# Altium project Backplane.PrjPcb
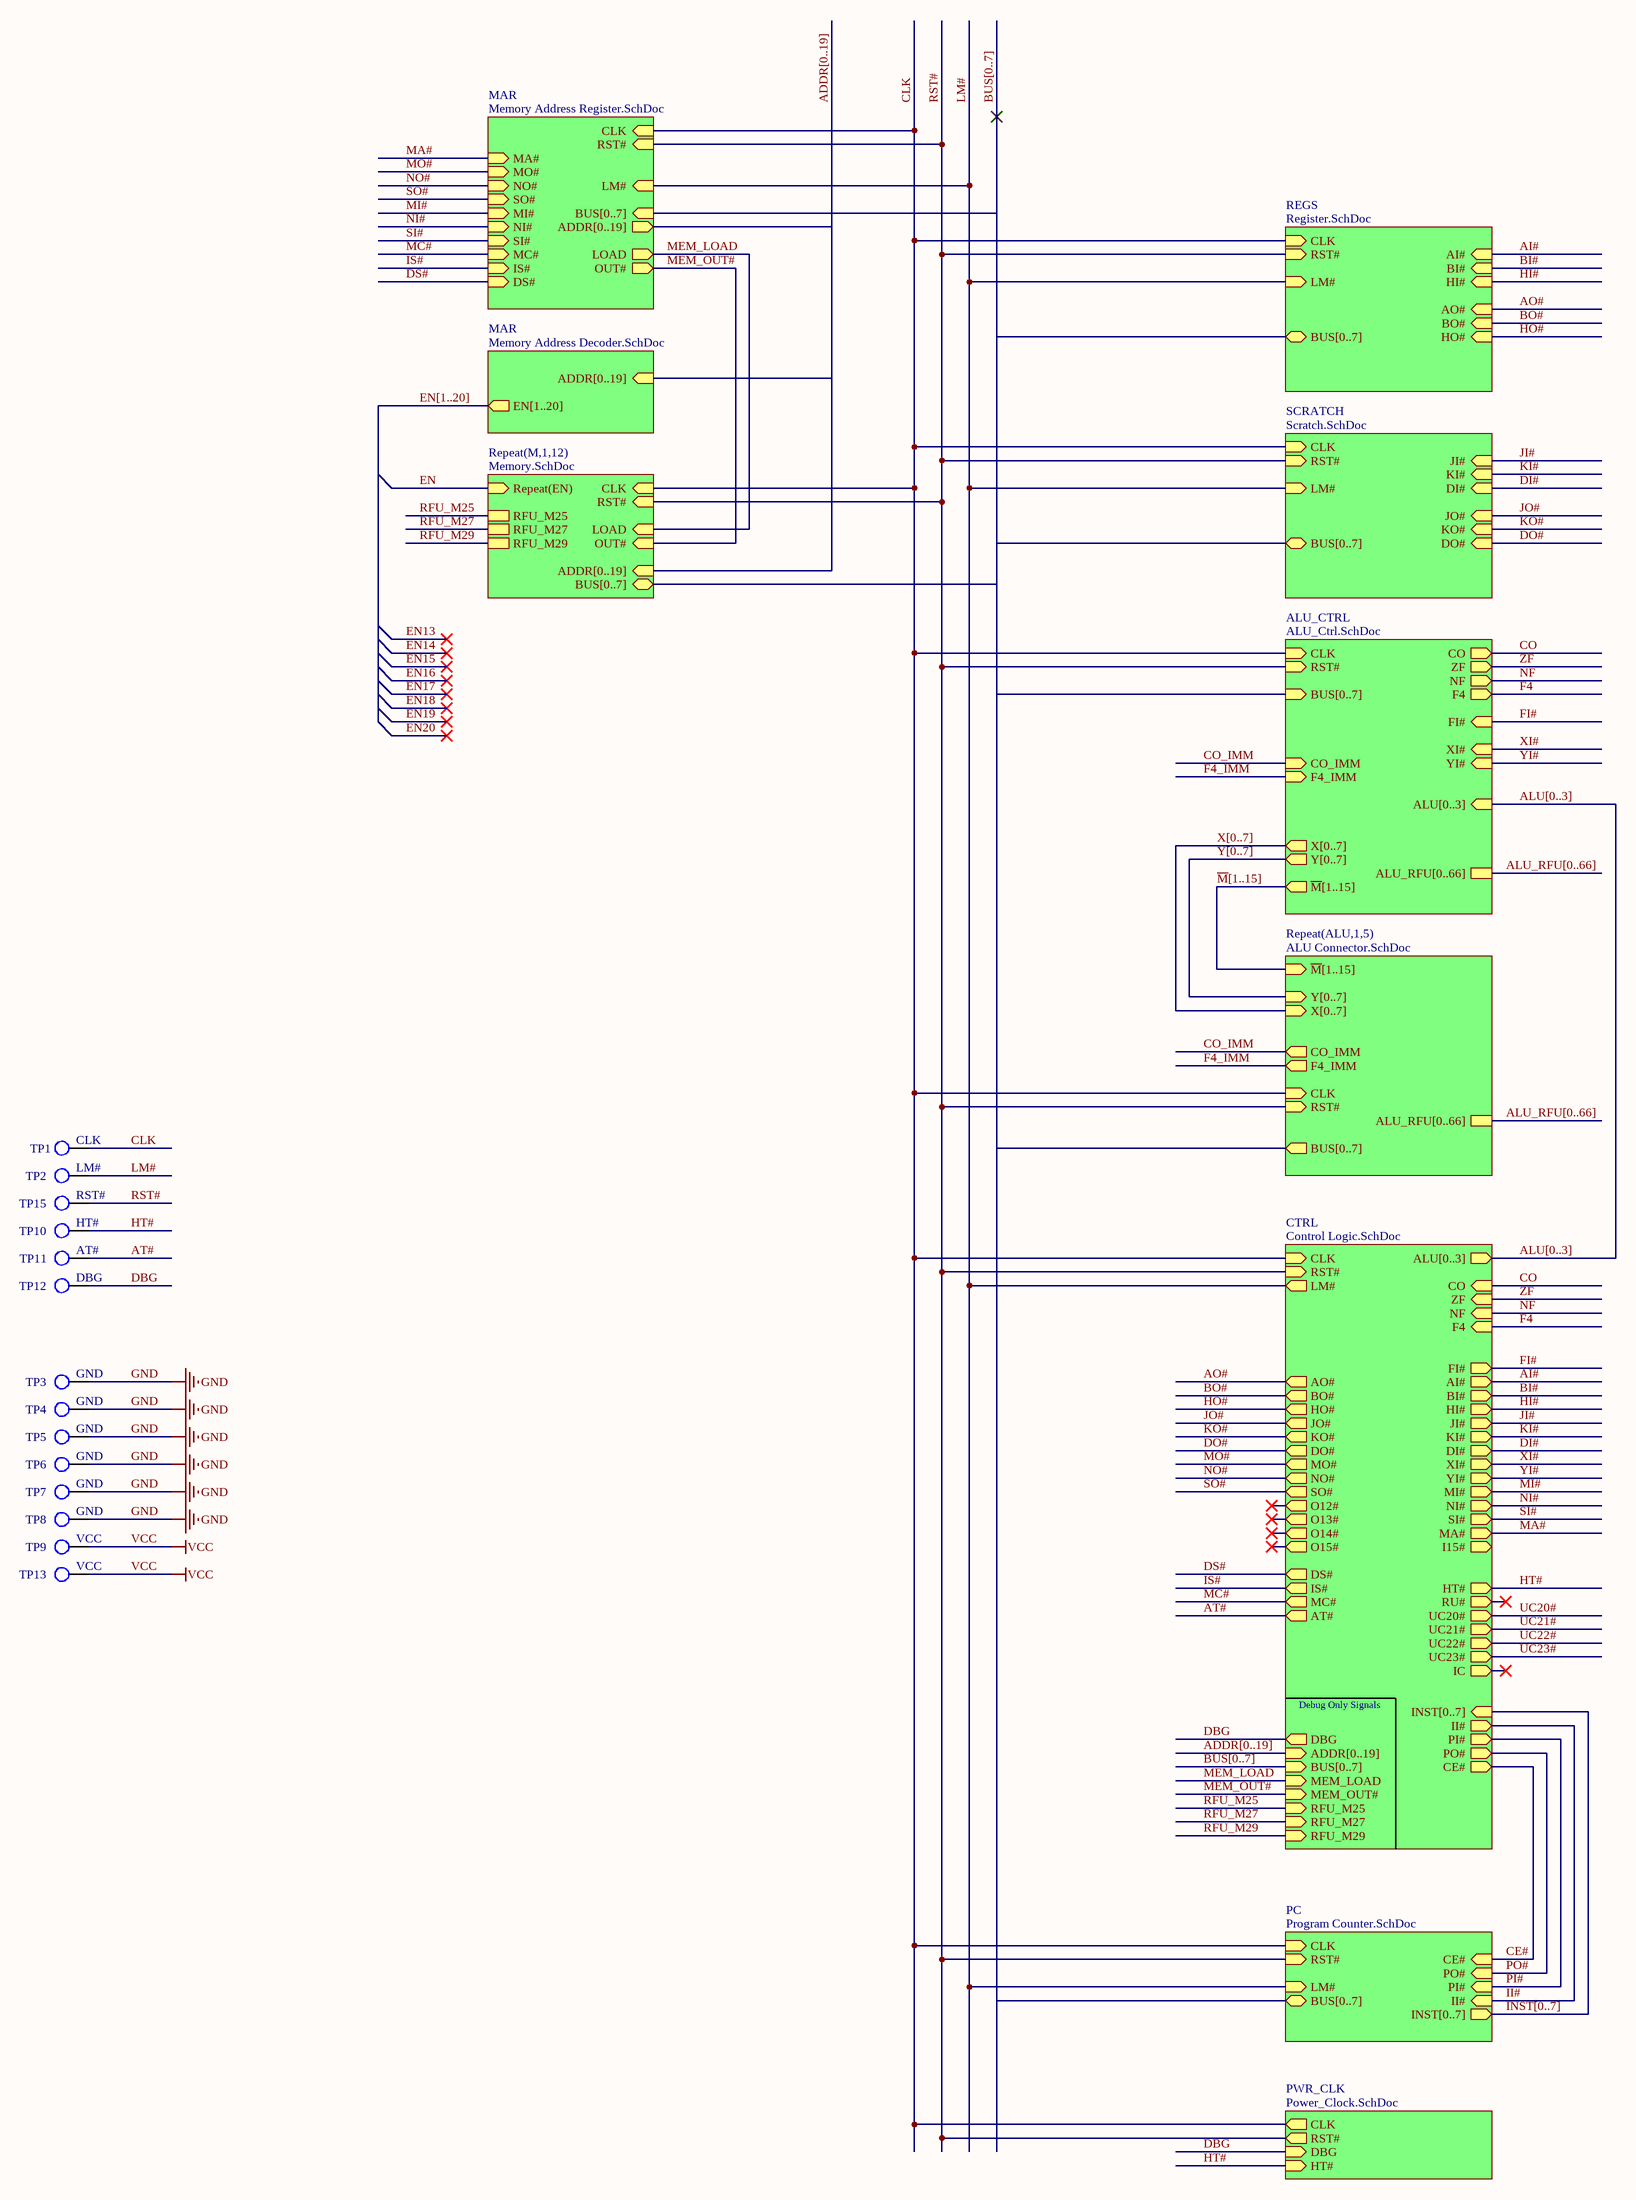
[diagram p0: Backplane.SchDoc]
11 sheets, 53 parts. Net scope: hierarchical (ports join the sheet entries above them; power ports are global).
Board file: Backplane.PcbDoc
Sheets:
  Backplane.SchDoc
    REGS = Register.SchDoc
    MAR = Memory Address Register.SchDoc
    M1 = Memory.SchDoc
    M2 = Memory.SchDoc
    M3 = Memory.SchDoc
    M4 = Memory.SchDoc
    M5 = Memory.SchDoc
    M6 = Memory.SchDoc
    M7 = Memory.SchDoc
    M8 = Memory.SchDoc
    M9 = Memory.SchDoc
    M10 = Memory.SchDoc
    M11 = Memory.SchDoc
    M12 = Memory.SchDoc
    PC = Program Counter.SchDoc
    SCRATCH = Scratch.SchDoc
    MAR = Memory Address Decoder.SchDoc
    CTRL = Control Logic.SchDoc
    ALU_CTRL = ALU_Ctrl.SchDoc
    ALU1 = ALU Connector.SchDoc
    ALU2 = ALU Connector.SchDoc
    ALU3 = ALU Connector.SchDoc
    ALU4 = ALU Connector.SchDoc
    ALU5 = ALU Connector.SchDoc
    PWR_CLK = Power_Clock.SchDoc

## Sheet Backplane.SchDoc
size C portrait; Author: E. Sims; Organization: Let's Build Rockets Inc.; SheetNumber: 1; SheetTotal: 11

### Parts
TP1  CLK  [KSTN-5011_V]  (no BOM)
TP2  LM#  [KSTN-5011_V]  (no BOM)
TP3  GND  [KSTN-5011_V]  (no BOM)
TP4  GND  [KSTN-5011_V]  (no BOM)
TP5  GND  [KSTN-5011_V]  (no BOM)
TP6  GND  [KSTN-5011_V]  (no BOM)
TP7  GND  [KSTN-5011_V]  (no BOM)
TP8  GND  [KSTN-5011_V]  (no BOM)
TP9  VCC  [KSTN-5011_V]  (no BOM)
TP10  HT#  [KSTN-5011_V]  (no BOM)
TP11  AT#  [KSTN-5011_V]  (no BOM)
TP12  DBG  [KSTN-5011_V]  (no BOM)
TP13  VCC  [KSTN-5011_V]  (no BOM)
TP15  RST#  [KSTN-5011_V]  (no BOM)

### Sub-sheets
ALU_CTRL = ALU_Ctrl.SchDoc: CLK (in), RST# (in), BUS[0..7] (in), CO (out), ZF (out), NF (out), CO_IMM (in), F4_IMM (in), F4 (out), FI# (in), XI# (in), ALU[0..3] (in), ~{M}[1..15] (out), YI# (in), Y[0..7] (out), X[0..7] (out), ALU_RFU[0..66]
CTRL = Control Logic.SchDoc: CLK (in), RST# (in), AI# (out), BI# (out), PI# (out), MO# (out), FI# (out), AO# (out), MA# (out), CE# (out), CO (in), ZF (in), ALU[0..3] (out), II# (out), PO# (out), INST[0..7] (in), O14# (out), YI# (out), KO# (out), O15# (out), O12# (out), HI# (out), O13# (out), HT# (out), DO# (out), XI# (out), KI# (out), DI# (out), NI# (out), MI# (out), JI# (out), I15# (out), SI# (out), BO# (out), UC22# (out), AT# (out), NO# (out), DS# (out), UC23# (out), SO# (out), JO# (out), LM# (out), IS# (out), MC# (out), HO# (out), IC (out), RU# (out), UC21# (out), UC20# (out), DBG (out), NF (in), F4 (in), ADDR[0..19] (in), BUS[0..7] (in), RFU_M29 (in), RFU_M25 (in), RFU_M27 (in), MEM_LOAD (in), MEM_OUT# (in)
MAR = Memory Address Register.SchDoc: ADDR[0..19] (out), CLK (in), BUS[0..7] (in), RST# (in), LM# (in), MO# (in), NO# (in), SO# (in), NI# (in), MI# (in), SI# (in), LOAD (out), OUT# (out), MA# (in), DS# (in), IS# (in), MC# (in)
MAR = Memory Address Decoder.SchDoc: ADDR[0..19] (in), EN[1..20] (out)
PC = Program Counter.SchDoc: LM# (in), CLK (in), RST# (in), PO# (in), PI# (in), CE# (in), II# (in), INST[0..7] (out), BUS[0..7] (bidir)
PWR_CLK = Power_Clock.SchDoc: CLK (out), RST# (out), DBG (in), HT# (in)
REGS = Register.SchDoc: CLK (in), RST# (in), BUS[0..7] (bidir), AI# (in), LM# (in), HO# (in), AO# (in), HI# (in), BI# (in), BO# (in)
Repeat(ALU,1,5) = ALU Connector.SchDoc: CO_IMM (out), Y[0..7] (in), X[0..7] (in), BUS[0..7] (out), ~{M}[1..15] (in), F4_IMM (out), CLK (in), RST# (in), ALU_RFU[0..66]
Repeat(M,1,12) = Memory.SchDoc: ADDR[0..19] (in), CLK (in), BUS[0..7] (bidir), LOAD (in), RST# (in), OUT# (in), Repeat(EN) (in), RFU_M29, RFU_M25, RFU_M27
SCRATCH = Scratch.SchDoc: CLK (in), RST# (in), BUS[0..7] (bidir), LM# (in), DO# (in), DI# (in), KO# (in), JI# (in), JO# (in), KI# (in)

### Nets
GND: TP3.1 TP4.1 TP5.1 TP6.1 TP7.1 TP8.1
VCC: TP9.1 TP13.1
AI#: sheet REGS/AI#, sheet CTRL/AI#
AO#: sheet REGS/AO#, sheet CTRL/AO#
AT#: TP11.1 ; sheet CTRL/AT#
BI#: sheet REGS/BI#, sheet CTRL/BI#
BO#: sheet REGS/BO#, sheet CTRL/BO#
CE#: sheet PC/CE#, sheet CTRL/CE#
CLK: TP1.1 ; sheet REGS/CLK, sheet MAR/CLK, sheet Repeat(M,1,12)/CLK, sheet PC/CLK, sheet SCRATCH/CLK, sheet CTRL/CLK, sheet ALU_CTRL/CLK, sheet Repeat(ALU,1,5)/CLK, sheet PWR_CLK/CLK
CO: sheet CTRL/CO, sheet ALU_CTRL/CO
CO_IMM: sheet ALU_CTRL/CO_IMM, sheet Repeat(ALU,1,5)/CO_IMM
DBG: TP12.1 ; sheet CTRL/DBG, sheet PWR_CLK/DBG
DI#: sheet SCRATCH/DI#, sheet CTRL/DI#
DO#: sheet SCRATCH/DO#, sheet CTRL/DO#
DS#: sheet MAR/DS#, sheet CTRL/DS#
EN: sheet Repeat(M,1,12)/Repeat(EN)
F4: sheet CTRL/F4, sheet ALU_CTRL/F4
F4_IMM: sheet ALU_CTRL/F4_IMM, sheet Repeat(ALU,1,5)/F4_IMM
FI#: sheet CTRL/FI#, sheet ALU_CTRL/FI#
HI#: sheet REGS/HI#, sheet CTRL/HI#
HO#: sheet REGS/HO#, sheet CTRL/HO#
HT#: TP10.1 ; sheet CTRL/HT#, sheet PWR_CLK/HT#
II#: sheet PC/II#, sheet CTRL/II#
IS#: sheet MAR/IS#, sheet CTRL/IS#
JI#: sheet SCRATCH/JI#, sheet CTRL/JI#
JO#: sheet SCRATCH/JO#, sheet CTRL/JO#
KI#: sheet SCRATCH/KI#, sheet CTRL/KI#
KO#: sheet SCRATCH/KO#, sheet CTRL/KO#
LM#: TP2.1 ; sheet REGS/LM#, sheet MAR/LM#, sheet PC/LM#, sheet SCRATCH/LM#, sheet CTRL/LM#
MA#: sheet MAR/MA#, sheet CTRL/MA#
MC#: sheet MAR/MC#, sheet CTRL/MC#
MEM_LOAD: sheet MAR/LOAD, sheet Repeat(M,1,12)/LOAD, sheet CTRL/MEM_LOAD
MEM_OUT#: sheet MAR/OUT#, sheet Repeat(M,1,12)/OUT#, sheet CTRL/MEM_OUT#
MI#: sheet MAR/MI#, sheet CTRL/MI#
MO#: sheet MAR/MO#, sheet CTRL/MO#
NF: sheet CTRL/NF, sheet ALU_CTRL/NF
NI#: sheet MAR/NI#, sheet CTRL/NI#
NO#: sheet MAR/NO#, sheet CTRL/NO#
PI#: sheet PC/PI#, sheet CTRL/PI#
PO#: sheet PC/PO#, sheet CTRL/PO#
RFU_M25: sheet Repeat(M,1,12)/RFU_M25, sheet CTRL/RFU_M25
RFU_M27: sheet Repeat(M,1,12)/RFU_M27, sheet CTRL/RFU_M27
RFU_M29: sheet Repeat(M,1,12)/RFU_M29, sheet CTRL/RFU_M29
RST#: TP15.1 ; sheet REGS/RST#, sheet MAR/RST#, sheet Repeat(M,1,12)/RST#, sheet PC/RST#, sheet SCRATCH/RST#, sheet CTRL/RST#, sheet ALU_CTRL/RST#, sheet Repeat(ALU,1,5)/RST#, sheet PWR_CLK/RST#
SI#: sheet MAR/SI#, sheet CTRL/SI#
SO#: sheet MAR/SO#, sheet CTRL/SO#
UC20#: sheet CTRL/UC20#
UC21#: sheet CTRL/UC21#
UC22#: sheet CTRL/UC22#
UC23#: sheet CTRL/UC23#
XI#: sheet CTRL/XI#, sheet ALU_CTRL/XI#
YI#: sheet CTRL/YI#, sheet ALU_CTRL/YI#
ZF: sheet CTRL/ZF, sheet ALU_CTRL/ZF

### Buses and harness runs
bus ADDR[0..19] = sheet CTRL/ADDR[0..19]
bus ADDR[0..19] = sheet MAR/ADDR[0..19] = sheet Repeat(M,1,12)/ADDR[0..19]
bus ALU[0..3] = sheet ALU_CTRL/ALU[0..3] = sheet CTRL/ALU[0..3]
bus ALU_RFU[0..66] = sheet ALU_CTRL/ALU_RFU[0..66]
bus ALU_RFU[0..66] = sheet Repeat(ALU,1,5)/ALU_RFU[0..66]
bus BUS[0..7] = sheet ALU_CTRL/BUS[0..7] = sheet MAR/BUS[0..7] = sheet PC/BUS[0..7] = sheet REGS/BUS[0..7] = sheet Repeat(ALU,1,5)/BUS[0..7] = sheet Repeat(M,1,12)/BUS[0..7] = sheet SCRATCH/BUS[0..7]
bus BUS[0..7] = sheet CTRL/BUS[0..7]
bus EN[1..20] = sheet MAR/EN[1..20]
bus INST[0..7] = sheet CTRL/INST[0..7] = sheet PC/INST[0..7]
bus X[0..7] = sheet ALU_CTRL/X[0..7] = sheet Repeat(ALU,1,5)/X[0..7]
bus Y[0..7] = sheet ALU_CTRL/Y[0..7] = sheet Repeat(ALU,1,5)/Y[0..7]
bus ~{M}[1..15] = sheet ALU_CTRL/~{M}[1..15] = sheet Repeat(ALU,1,5)/~{M}[1..15]

### Notes on the sheet
- Debug Only Signals
- Let's Build Rocket's Inc. Modular Paylaod System Based on TMP-010 Rev
  For more information visit https://github.com/LetsBuildRockets/Modular-Payload-System
  This work is licensed under CC BY-NC 4.0. To view a copy of this license, visit https://creativecommons.org/licenses/by-nc/4.0
- Title
- Size:
- Date:
- Assembly Variant:
- B
- Number:
- Time:
- Revision:
- Sheet
- of
- Author:
- File:

### Library data of the parts
TP1-TP13 TP15 = TP

## Sheet Register.SchDoc
size A; Author: E. Sims; Organization: Let's Build Rockets Inc.; SheetNumber: 5; SheetTotal: 11
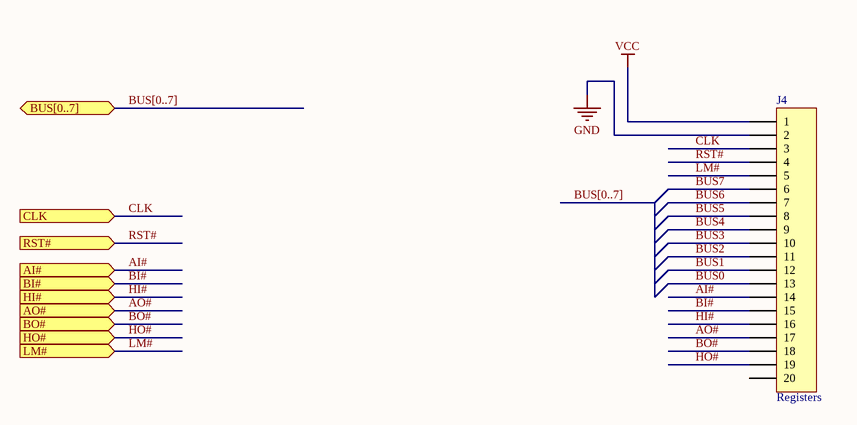
[diagram p1: Register.SchDoc]

### Parts
J4  Registers  [HDR1X20]

### Ports
AI# (in), AO# (in), BI# (in), BO# (in), BUS[0..7] (bidir), CLK (in), HI# (in), HO# (in), LM# (in), RST# (in)

### Nets
GND: J4.2
VCC: J4.1
AI#: J4.14 ; port AI#
AO#: J4.17 ; port AO#
BI#: J4.15 ; port BI#
BO#: J4.18 ; port BO#
BUS0: J4.13
BUS1: J4.12
BUS2: J4.11
BUS3: J4.10
BUS4: J4.9
BUS5: J4.8
BUS6: J4.7
BUS7: J4.6
CLK: J4.3 ; port CLK
HI#: J4.16 ; port HI#
HO#: J4.19 ; port HO#
LM#: J4.5 ; port LM#
RST#: J4.4 ; port RST#

Not connected (* = marked no-connect by the designer): J4 20

### Buses and harness runs
bus BUS[0..7]
bus BUS[0..7] = port BUS[0..7]

### Notes on the sheet
- Let's Build Rocket's Inc. Modular Paylaod System Based on TMP-010 Rev
  For more information visit https://github.com/LetsBuildRockets/Modular-Payload-System
  This work is licensed under CC BY-NC 4.0. To view a copy of this license, visit https://creativecommons.org/licenses/by-nc/4.0
- Title
- Size:
- Date:
- Assembly Variant:
- B
- Number:
- Time:
- Revision:
- Sheet
- of
- Author:
- File:

### Library data of the parts
J4 = Header 20: Header, 20-Pin; System: Connector; LatestRevisionDate: 17-Jul-2002; LatestRevisionNote: Re-released for DXP Platform.; Publisher: Altium Limited

## Sheet Memory Address Register.SchDoc
size A; Author: E. Sims; Organization: Let's Build Rockets Inc.; SheetNumber: 2; SheetTotal: 11
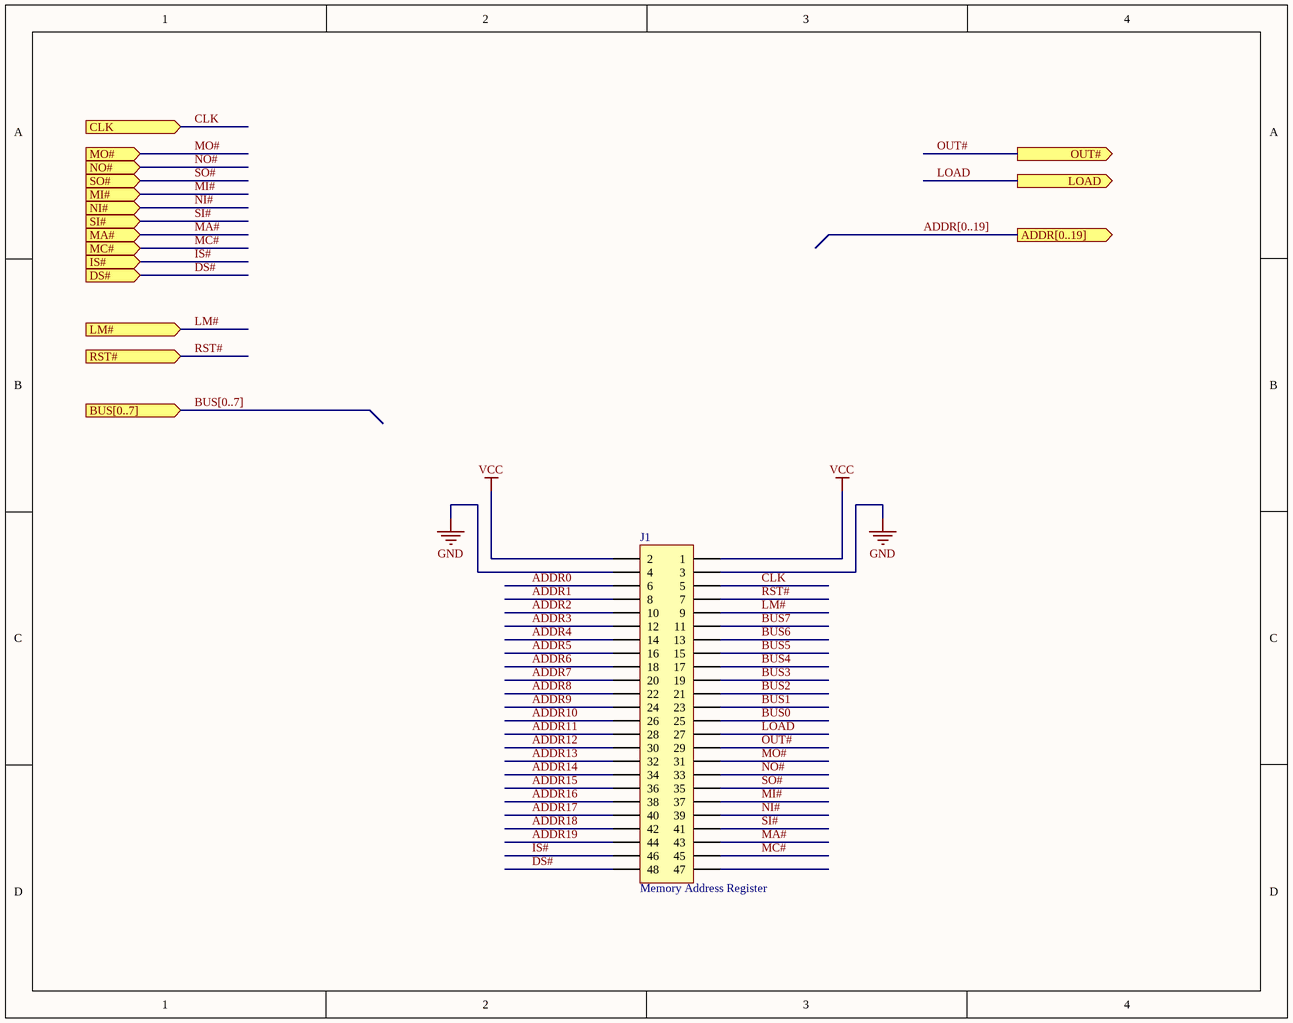
[diagram p2: Memory Address Register.SchDoc]

### Parts
J1  Memory Address Register  [HDR2X24]

### Ports
ADDR[0..19] (out), BUS[0..7] (in), CLK (in), DS# (in), IS# (in), LM# (in), LOAD (out), MA# (in), MC# (in), MI# (in), MO# (in), NI# (in), NO# (in), OUT# (out), RST# (in), SI# (in), SO# (in)

### Nets
GND: J1.3 J1.4
VCC: J1.1 J1.2
ADDR0: J1.6
ADDR1: J1.8
ADDR2: J1.10
ADDR3: J1.12
ADDR4: J1.14
ADDR5: J1.16
ADDR6: J1.18
ADDR7: J1.20
ADDR8: J1.22
ADDR9: J1.24
ADDR10: J1.26
ADDR11: J1.28
ADDR12: J1.30
ADDR13: J1.32
ADDR14: J1.34
ADDR15: J1.36
ADDR16: J1.38
ADDR17: J1.40
ADDR18: J1.42
ADDR19: J1.44
BUS0: J1.25
BUS1: J1.23
BUS2: J1.21
BUS3: J1.19
BUS4: J1.17
BUS5: J1.15
BUS6: J1.13
BUS7: J1.11
CLK: J1.5 ; port CLK
DS#: J1.48 ; port DS#
IS#: J1.46 ; port IS#
LM#: J1.9 ; port LM#
LOAD: J1.27 ; port LOAD  [project net MEM_LOAD]
MA#: J1.43 ; port MA#
MC#: J1.45 ; port MC#
MI#: J1.37 ; port MI#
MO#: J1.31 ; port MO#
NI#: J1.39 ; port NI#
NO#: J1.33 ; port NO#
OUT#: J1.29 ; port OUT#  [project net MEM_OUT#]
RST#: J1.7 ; port RST#
SI#: J1.41 ; port SI#
SO#: J1.35 ; port SO#

Not connected (* = marked no-connect by the designer): J1 47

### Buses and harness runs
bus ADDR[0..19] = port ADDR[0..19]
bus BUS[0..7] = port BUS[0..7]

### Notes on the sheet
- Let's Build Rocket's Inc. Modular Paylaod System Based on TMP-010 Rev
  For more information visit https://github.com/LetsBuildRockets/Modular-Payload-System
  This work is licensed under CC BY-NC 4.0. To view a copy of this license, visit https://creativecommons.org/licenses/by-nc/4.0
- Title
- Size:
- Date:
- Assembly Variant:
- B
- Number:
- Time:
- Revision:
- Sheet
- of
- Author:
- File:

### Library data of the parts
J1 = Header 24x2: Header, 24-Pin, Dual row; System: Connector; LatestRevisionDate: 17-Jul-2002; LatestRevisionNote: Re-released for DXP Platform.; Publisher: Altium Limited

## Sheet Memory.SchDoc
size A; Author: E. Sims; Organization: Let's Build Rockets Inc.; SheetNumber: 3; SheetTotal: 11
Used 12 times, as channels M1, M2, M3, M4, M5, M6, M7, M8, M9, M10, M11, M12. Parts and nets are listed once, with the designators drawn on the sheet.
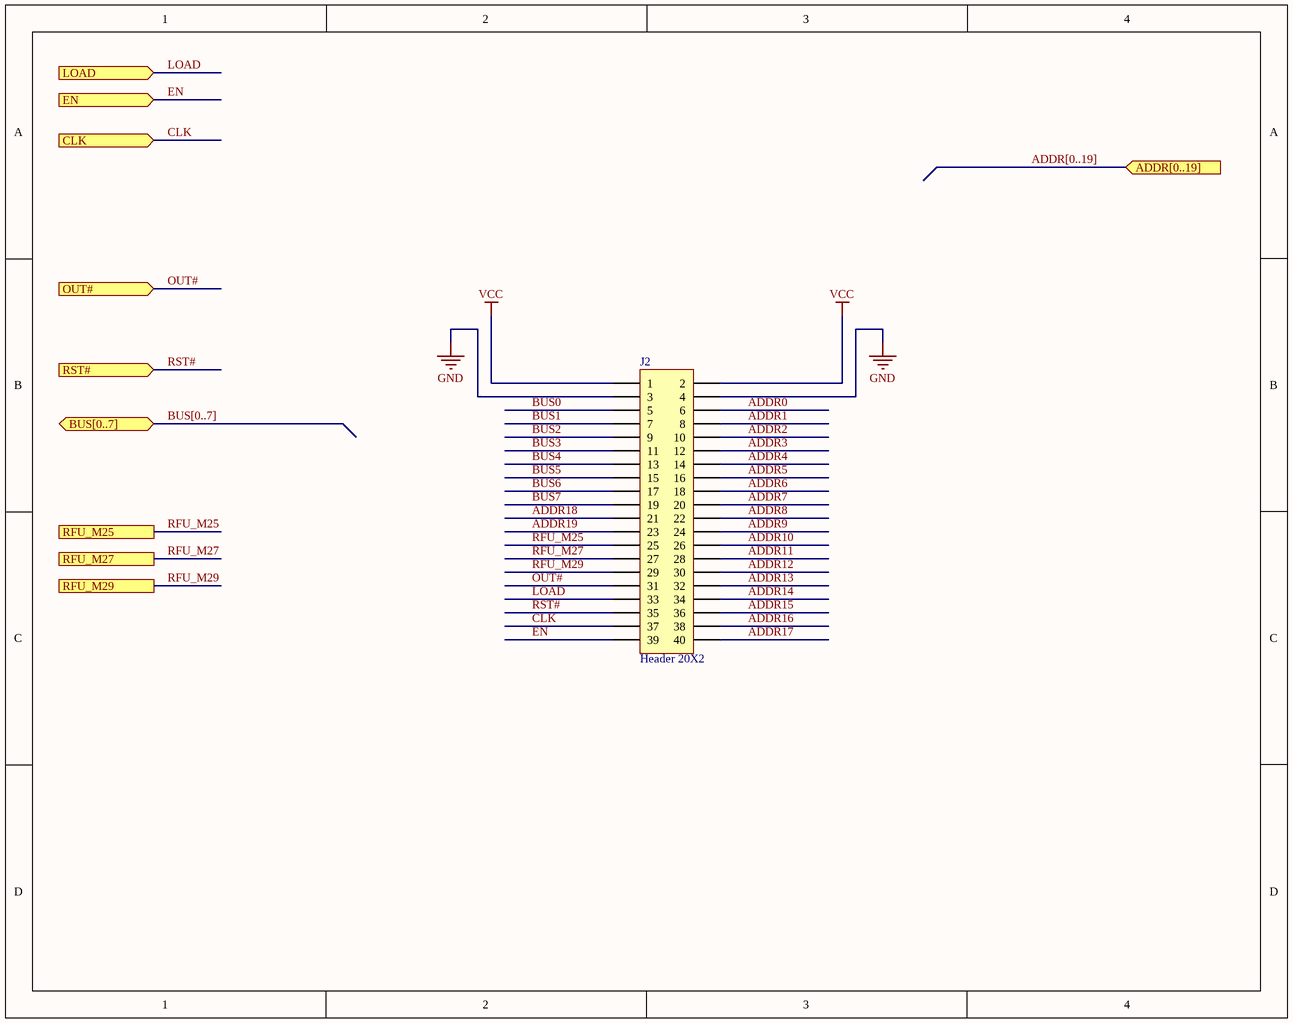
[diagram p3: Memory.SchDoc]

### Parts
J2  Header 20X2  [HDR2X20]

### Ports
ADDR[0..19] (in), BUS[0..7] (bidir), CLK (in), EN (in), LOAD (in), OUT# (in), RFU_M25, RFU_M27, RFU_M29, RST# (in)

### Nets
GND: J2.3 J2.4
VCC: J2.1 J2.2
ADDR0: J2.6
ADDR1: J2.8
ADDR2: J2.10
ADDR3: J2.12
ADDR4: J2.14
ADDR5: J2.16
ADDR6: J2.18
ADDR7: J2.20
ADDR8: J2.22
ADDR9: J2.24
ADDR10: J2.26
ADDR11: J2.28
ADDR12: J2.30
ADDR13: J2.32
ADDR14: J2.34
ADDR15: J2.36
ADDR16: J2.38
ADDR17: J2.40
ADDR18: J2.21
ADDR19: J2.23
BUS0: J2.5
BUS1: J2.7
BUS2: J2.9
BUS3: J2.11
BUS4: J2.13
BUS5: J2.15
BUS6: J2.17
BUS7: J2.19
CLK: J2.37 ; port CLK
EN: J2.39 ; port EN
LOAD: J2.33 ; port LOAD
OUT#: J2.31 ; port OUT#
RFU_M25: J2.25 ; port RFU_M25
RFU_M27: J2.27 ; port RFU_M27
RFU_M29: J2.29 ; port RFU_M29
RST#: J2.35 ; port RST#

### Channels
M1: designators end in 1; ports CLK=CLK EN=EN1 LOAD=MEM_LOAD OUT#=MEM_OUT# RFU_M25=RFU_M25 RFU_M27=RFU_M27 RFU_M29=RFU_M29 RST#=RST#
M2: designators end in 2; ports CLK=CLK EN=EN2 LOAD=MEM_LOAD OUT#=MEM_OUT# RFU_M25=RFU_M25 RFU_M27=RFU_M27 RFU_M29=RFU_M29 RST#=RST#
M3: designators end in 3; ports CLK=CLK EN=EN3 LOAD=MEM_LOAD OUT#=MEM_OUT# RFU_M25=RFU_M25 RFU_M27=RFU_M27 RFU_M29=RFU_M29 RST#=RST#
M4: designators end in 4; ports CLK=CLK EN=EN4 LOAD=MEM_LOAD OUT#=MEM_OUT# RFU_M25=RFU_M25 RFU_M27=RFU_M27 RFU_M29=RFU_M29 RST#=RST#
M5: designators end in 5; ports CLK=CLK EN=EN5 LOAD=MEM_LOAD OUT#=MEM_OUT# RFU_M25=RFU_M25 RFU_M27=RFU_M27 RFU_M29=RFU_M29 RST#=RST#
M6: designators end in 6; ports CLK=CLK EN=EN6 LOAD=MEM_LOAD OUT#=MEM_OUT# RFU_M25=RFU_M25 RFU_M27=RFU_M27 RFU_M29=RFU_M29 RST#=RST#
M7: designators end in 7; ports CLK=CLK EN=EN7 LOAD=MEM_LOAD OUT#=MEM_OUT# RFU_M25=RFU_M25 RFU_M27=RFU_M27 RFU_M29=RFU_M29 RST#=RST#
M8: designators end in 8; ports CLK=CLK EN=EN8 LOAD=MEM_LOAD OUT#=MEM_OUT# RFU_M25=RFU_M25 RFU_M27=RFU_M27 RFU_M29=RFU_M29 RST#=RST#
M9: designators end in 9; ports CLK=CLK EN=EN9 LOAD=MEM_LOAD OUT#=MEM_OUT# RFU_M25=RFU_M25 RFU_M27=RFU_M27 RFU_M29=RFU_M29 RST#=RST#
M10: designators end in 10; ports CLK=CLK EN=EN10 LOAD=MEM_LOAD OUT#=MEM_OUT# RFU_M25=RFU_M25 RFU_M27=RFU_M27 RFU_M29=RFU_M29 RST#=RST#
M11: designators end in 11; ports CLK=CLK EN=EN11 LOAD=MEM_LOAD OUT#=MEM_OUT# RFU_M25=RFU_M25 RFU_M27=RFU_M27 RFU_M29=RFU_M29 RST#=RST#
M12: designators end in 12; ports CLK=CLK EN=EN12 LOAD=MEM_LOAD OUT#=MEM_OUT# RFU_M25=RFU_M25 RFU_M27=RFU_M27 RFU_M29=RFU_M29 RST#=RST#

### Buses and harness runs
bus ADDR[0..19] = port ADDR[0..19]
bus BUS[0..7] = port BUS[0..7]

### Notes on the sheet
- Let's Build Rocket's Inc. Modular Paylaod System Based on TMP-010 Rev
  For more information visit https://github.com/LetsBuildRockets/Modular-Payload-System
  This work is licensed under CC BY-NC 4.0. To view a copy of this license, visit https://creativecommons.org/licenses/by-nc/4.0
- Title
- Size:
- Date:
- Assembly Variant:
- B
- Number:
- Time:
- Revision:
- Sheet
- of
- Author:
- File:

### Library data of the parts
J2 = Header 20X2: Header, 20-Pin, Dual row; System: Connector; LatestRevisionDate: 17-Jul-2002; LatestRevisionNote: Re-released for DXP Platform.; Publisher: Altium Limited

## Sheet Program Counter.SchDoc
size B; Author: E. Sims; Organization: Let's Build Rockets Inc.; SheetNumber: 4; SheetTotal: 11
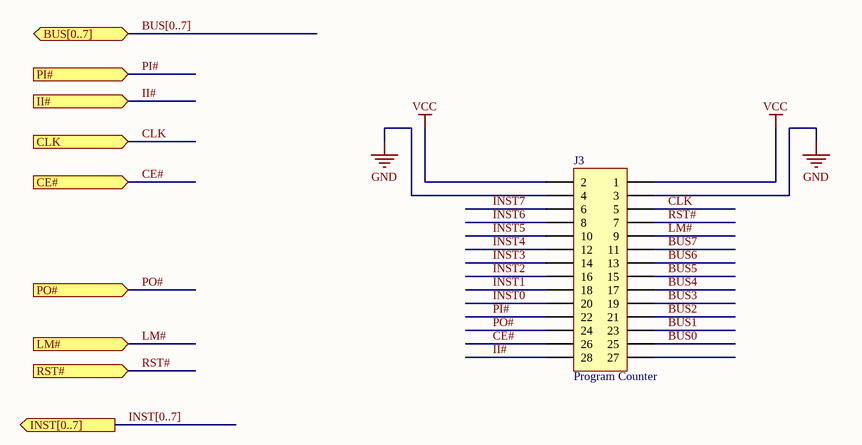
[diagram p4: Program Counter.SchDoc]

### Parts
J3  Program Counter  [HDR2X14]

### Ports
BUS[0..7] (bidir), CE# (in), CLK (in), II# (in), INST[0..7] (out), LM# (in), PI# (in), PO# (in), RST# (in)

### Nets
GND: J3.3 J3.4
VCC: J3.1 J3.2
BUS0: J3.25
BUS1: J3.23
BUS2: J3.21
BUS3: J3.19
BUS4: J3.17
BUS5: J3.15
BUS6: J3.13
BUS7: J3.11
CE#: J3.26 ; port CE#
CLK: J3.5 ; port CLK
II#: J3.28 ; port II#
INST0: J3.20
INST1: J3.18
INST2: J3.16
INST3: J3.14
INST4: J3.12
INST5: J3.10
INST6: J3.8
INST7: J3.6
LM#: J3.9 ; port LM#
PI#: J3.22 ; port PI#
PO#: J3.24 ; port PO#
RST#: J3.7 ; port RST#

Not connected (* = marked no-connect by the designer): J3 27

### Buses and harness runs
bus BUS[0..7] = port BUS[0..7]
bus INST[0..7] = port INST[0..7]

### Notes on the sheet
- Let's Build Rocket's Inc. Modular Paylaod System Based on TMP-010 Rev
  For more information visit https://github.com/LetsBuildRockets/Modular-Payload-System
  This work is licensed under CC BY-NC 4.0. To view a copy of this license, visit https://creativecommons.org/licenses/by-nc/4.0
- Title
- Size:
- Date:
- Assembly Variant:
- B
- Number:
- Time:
- Revision:
- Sheet
- of
- Author:
- File:

### Library data of the parts
J3 = Header 14X2: Header, 14-Pin, Dual row; System: Connector; LatestRevisionDate: 17-Jul-2002; LatestRevisionNote: Re-released for DXP Platform.; Publisher: Altium Limited

## Sheet Scratch.SchDoc
size A; Author: E. Sims; Organization: Let's Build Rockets Inc.; SheetNumber: 6; SheetTotal: 11
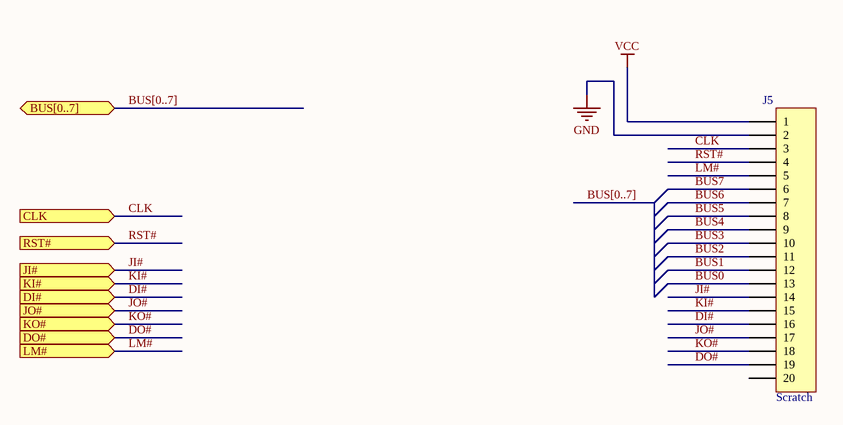
[diagram p5: Scratch.SchDoc]

### Parts
J5  Scratch  [HDR1X20]

### Ports
BUS[0..7] (bidir), CLK (in), DI# (in), DO# (in), JI# (in), JO# (in), KI# (in), KO# (in), LM# (in), RST# (in)

### Nets
GND: J5.2
VCC: J5.1
BUS0: J5.13
BUS1: J5.12
BUS2: J5.11
BUS3: J5.10
BUS4: J5.9
BUS5: J5.8
BUS6: J5.7
BUS7: J5.6
CLK: J5.3 ; port CLK
DI#: J5.16 ; port DI#
DO#: J5.19 ; port DO#
JI#: J5.14 ; port JI#
JO#: J5.17 ; port JO#
KI#: J5.15 ; port KI#
KO#: J5.18 ; port KO#
LM#: J5.5 ; port LM#
RST#: J5.4 ; port RST#

Not connected (* = marked no-connect by the designer): J5 20

### Buses and harness runs
bus BUS[0..7]
bus BUS[0..7] = port BUS[0..7]

### Notes on the sheet
- Let's Build Rocket's Inc. Modular Paylaod System Based on TMP-010 Rev
  For more information visit https://github.com/LetsBuildRockets/Modular-Payload-System
  This work is licensed under CC BY-NC 4.0. To view a copy of this license, visit https://creativecommons.org/licenses/by-nc/4.0
- Title
- Size:
- Date:
- Assembly Variant:
- B
- Number:
- Time:
- Revision:
- Sheet
- of
- Author:
- File:

### Library data of the parts
J5 = Header 20: Header, 20-Pin; System: Connector; LatestRevisionDate: 17-Jul-2002; LatestRevisionNote: Re-released for DXP Platform.; Publisher: Altium Limited

## Sheet Memory Address Decoder.SchDoc
size A; Author: E. Sims; Organization: Let's Build Rockets Inc.; SheetNumber: 10; SheetTotal: 11
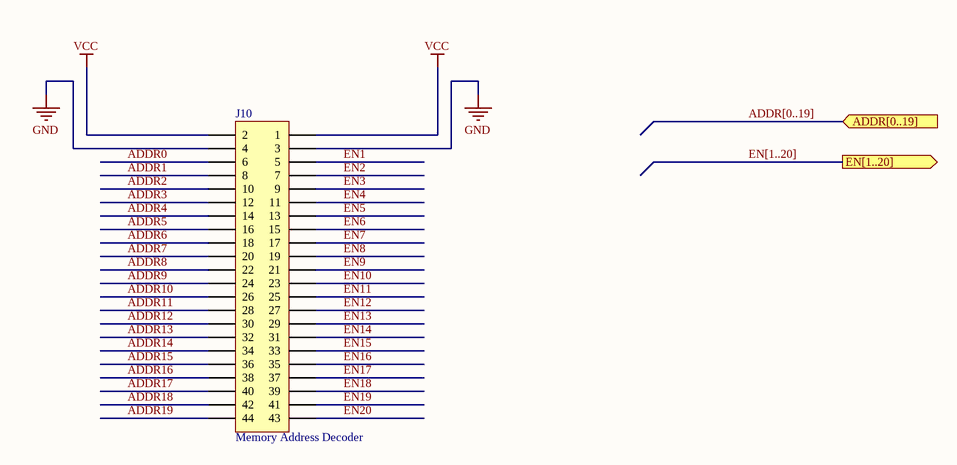
[diagram p6: Memory Address Decoder.SchDoc]

### Parts
J10  Memory Address Decoder  [HDR2X22]

### Ports
ADDR[0..19] (in), EN[1..20] (out)

### Nets
GND: J10.3 J10.4
VCC: J10.1 J10.2
ADDR0: J10.6
ADDR1: J10.8
ADDR2: J10.10
ADDR3: J10.12
ADDR4: J10.14
ADDR5: J10.16
ADDR6: J10.18
ADDR7: J10.20
ADDR8: J10.22
ADDR9: J10.24
ADDR10: J10.26
ADDR11: J10.28
ADDR12: J10.30
ADDR13: J10.32
ADDR14: J10.34
ADDR15: J10.36
ADDR16: J10.38
ADDR17: J10.40
ADDR18: J10.42
ADDR19: J10.44
EN1: J10.5
EN2: J10.7
EN3: J10.9
EN4: J10.11
EN5: J10.13
EN6: J10.15
EN7: J10.17
EN8: J10.19
EN9: J10.21
EN10: J10.23
EN11: J10.25
EN12: J10.27
EN13: J10.29
EN14: J10.31
EN15: J10.33
EN16: J10.35
EN17: J10.37
EN18: J10.39
EN19: J10.41
EN20: J10.43

### Buses and harness runs
bus ADDR[0..19] = port ADDR[0..19]
bus EN[1..20] = port EN[1..20]

### Notes on the sheet
- Let's Build Rocket's Inc. Modular Paylaod System Based on TMP-010 Rev
  For more information visit https://github.com/LetsBuildRockets/Modular-Payload-System
  This work is licensed under CC BY-NC 4.0. To view a copy of this license, visit https://creativecommons.org/licenses/by-nc/4.0
- Title
- Size:
- Date:
- Assembly Variant:
- B
- Number:
- Time:
- Revision:
- Sheet
- of
- Author:
- File:

### Library data of the parts
J10 = Header 22X2: Header, 22-Pin, Dual row; System: Connector; LatestRevisionDate: 17-Jul-2002; LatestRevisionNote: Re-released for DXP Platform.; Publisher: Altium Limited

## Sheet Control Logic.SchDoc
size B; Author: E. Sims; Organization: Let's Build Rockets Inc.; SheetNumber: 8; SheetTotal: 11
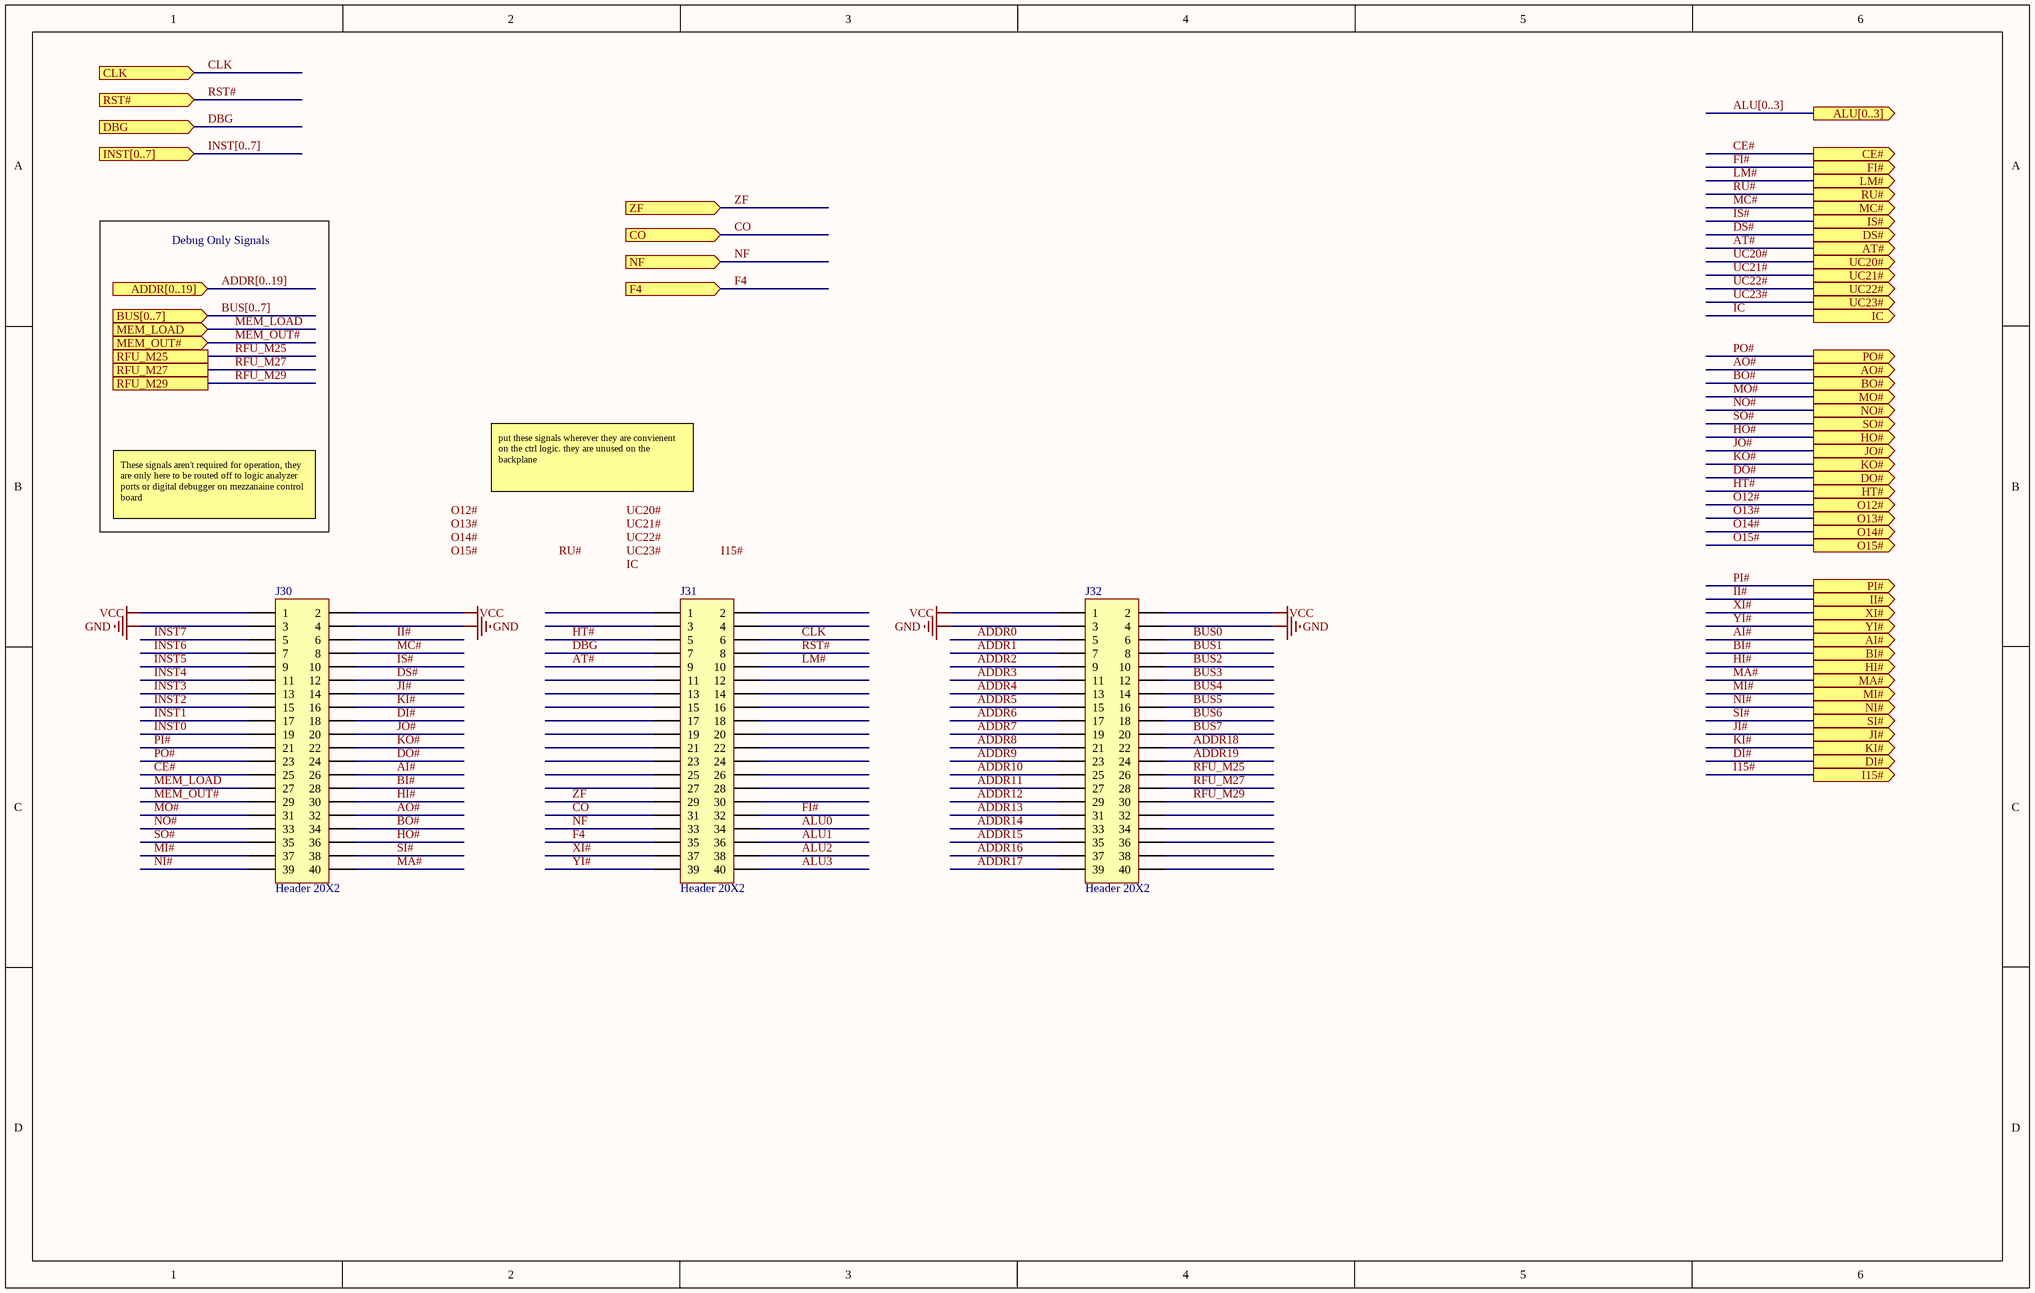
[diagram p7: Control Logic.SchDoc]

### Parts
J30  Header 20X2  [HDR2X20]
J31  Header 20X2  [HDR2X20]
J32  Header 20X2  [HDR2X20]

### Ports
ADDR[0..19] (in), AI# (out), ALU[0..3] (out), AO# (out), AT# (out), BI# (out), BO# (out), BUS[0..7] (in), CE# (out), CLK (in), CO (in), DBG (in), DI# (out), DO# (out), DS# (out), F4 (in), FI# (out), HI# (out), HO# (out), HT# (out), I15# (out), IC (out), II# (out), INST[0..7] (in), IS# (out), JI# (out), JO# (out), KI# (out), KO# (out), LM# (out), MA# (out), MC# (out), MEM_LOAD (in), MEM_OUT# (in), MI# (out), MO# (out), NF (in), NI# (out), NO# (out), O12# (out), O13# (out), O14# (out), O15# (out), PI# (out), PO# (out), RFU_M25, RFU_M27, RFU_M29, RST# (in), RU# (out), SI# (out), SO# (out), UC20# (out), UC21# (out), UC22# (out), UC23# (out), XI# (out), YI# (out), ZF (in)

### Nets
GND: J30.3 J30.4 J32.3 J32.4
VCC: J30.1 J30.2 J32.1 J32.2
ADDR0: J32.5
ADDR1: J32.7
ADDR2: J32.9
ADDR3: J32.11
ADDR4: J32.13
ADDR5: J32.15
ADDR6: J32.17
ADDR7: J32.19
ADDR8: J32.21
ADDR9: J32.23
ADDR10: J32.25
ADDR11: J32.27
ADDR12: J32.29
ADDR13: J32.31
ADDR14: J32.33
ADDR15: J32.35
ADDR16: J32.37
ADDR17: J32.39
ADDR18: J32.22
ADDR19: J32.24
AI#: J30.26 ; port AI#
ALU0: J31.34
ALU1: J31.36
ALU2: J31.38
ALU3: J31.40
AO#: J30.32 ; port AO#
AT#: J31.9 ; port AT#
BI#: J30.28 ; port BI#
BO#: J30.34 ; port BO#
BUS0: J32.6
BUS1: J32.8
BUS2: J32.10
BUS3: J32.12
BUS4: J32.14
BUS5: J32.16
BUS6: J32.18
BUS7: J32.20
CE#: J30.25 ; port CE#
CLK: J31.6 ; port CLK
CO: J31.31 ; port CO
DBG: J31.7 ; port DBG
DI#: J30.18 ; port DI#
DO#: J30.24 ; port DO#
DS#: J30.12 ; port DS#
F4: J31.35 ; port F4
FI#: J31.32 ; port FI#
HI#: J30.30 ; port HI#
HO#: J30.36 ; port HO#
HT#: J31.5 ; port HT#
I15#: port I15#
IC: port IC
II#: J30.6 ; port II#
INST0: J30.19
INST1: J30.17
INST2: J30.15
INST3: J30.13
INST4: J30.11
INST5: J30.9
INST6: J30.7
INST7: J30.5
IS#: J30.10 ; port IS#
JI#: J30.14 ; port JI#
JO#: J30.20 ; port JO#
KI#: J30.16 ; port KI#
KO#: J30.22 ; port KO#
LM#: J31.10 ; port LM#
MA#: J30.40 ; port MA#
MC#: J30.8 ; port MC#
MEM_LOAD: J30.27 ; port MEM_LOAD
MEM_OUT#: J30.29 ; port MEM_OUT#
MI#: J30.37 ; port MI#
MO#: J30.31 ; port MO#
NF: J31.33 ; port NF
NI#: J30.39 ; port NI#
NO#: J30.33 ; port NO#
O12#: port O12#
O13#: port O13#
O14#: port O14#
O15#: port O15#
PI#: J30.21 ; port PI#
PO#: J30.23 ; port PO#
RFU_M25: J32.26 ; port RFU_M25
RFU_M27: J32.28 ; port RFU_M27
RFU_M29: J32.30 ; port RFU_M29
RST#: J31.8 ; port RST#
RU#: port RU#
SI#: J30.38 ; port SI#
SO#: J30.35 ; port SO#
UC20#: port UC20#
UC21#: port UC21#
UC22#: port UC22#
UC23#: port UC23#
XI#: J31.37 ; port XI#
YI#: J31.39 ; port YI#
ZF: J31.29 ; port ZF

Not connected (* = marked no-connect by the designer): J31 1 2 3 4 11 12 13 14 15 16 17 18 19 20 21 22 23 24 25 26 27 28 30; J32 32 34 36 38 40

### Buses and harness runs
bus ADDR[0..19] = port ADDR[0..19]
bus ALU[0..3] = port ALU[0..3]
bus BUS[0..7] = port BUS[0..7]
bus INST[0..7] = port INST[0..7]

### Notes on the sheet
- Debug Only Signals
- put these signals wherever they are convienent on the ctrl logic. they are unused on the backplane
- These signals aren't required for operation, they are only here to be routed off to logic analyzer ports or digital debugger on mezzanaine control board
- Labels drawn without touching a wire or pin: I15#, IC, O12#, O13#, O14#, O15#, RU#, UC20#, UC21#, UC22#, UC23#
- Let's Build Rocket's Inc. Modular Paylaod System Based on TMP-010 Rev
  For more information visit https://github.com/LetsBuildRockets/Modular-Payload-System
  This work is licensed under CC BY-NC 4.0. To view a copy of this license, visit https://creativecommons.org/licenses/by-nc/4.0
- Title
- Size:
- Date:
- Assembly Variant:
- B
- Number:
- Time:
- Revision:
- Sheet
- of
- Author:
- File:

### Library data of the parts
J30-J32 = Header 20X2: as J2 on sheet Memory; LatestRevisionDate: 17-Jul-2002; LatestRevisionNote: Re-released for DXP Platform.; Publisher: Altium Limited

## Sheet ALU_Ctrl.SchDoc
size A; Author: E. Sims; Organization: Let's Build Rockets Inc.; SheetNumber: 7; SheetTotal: 11
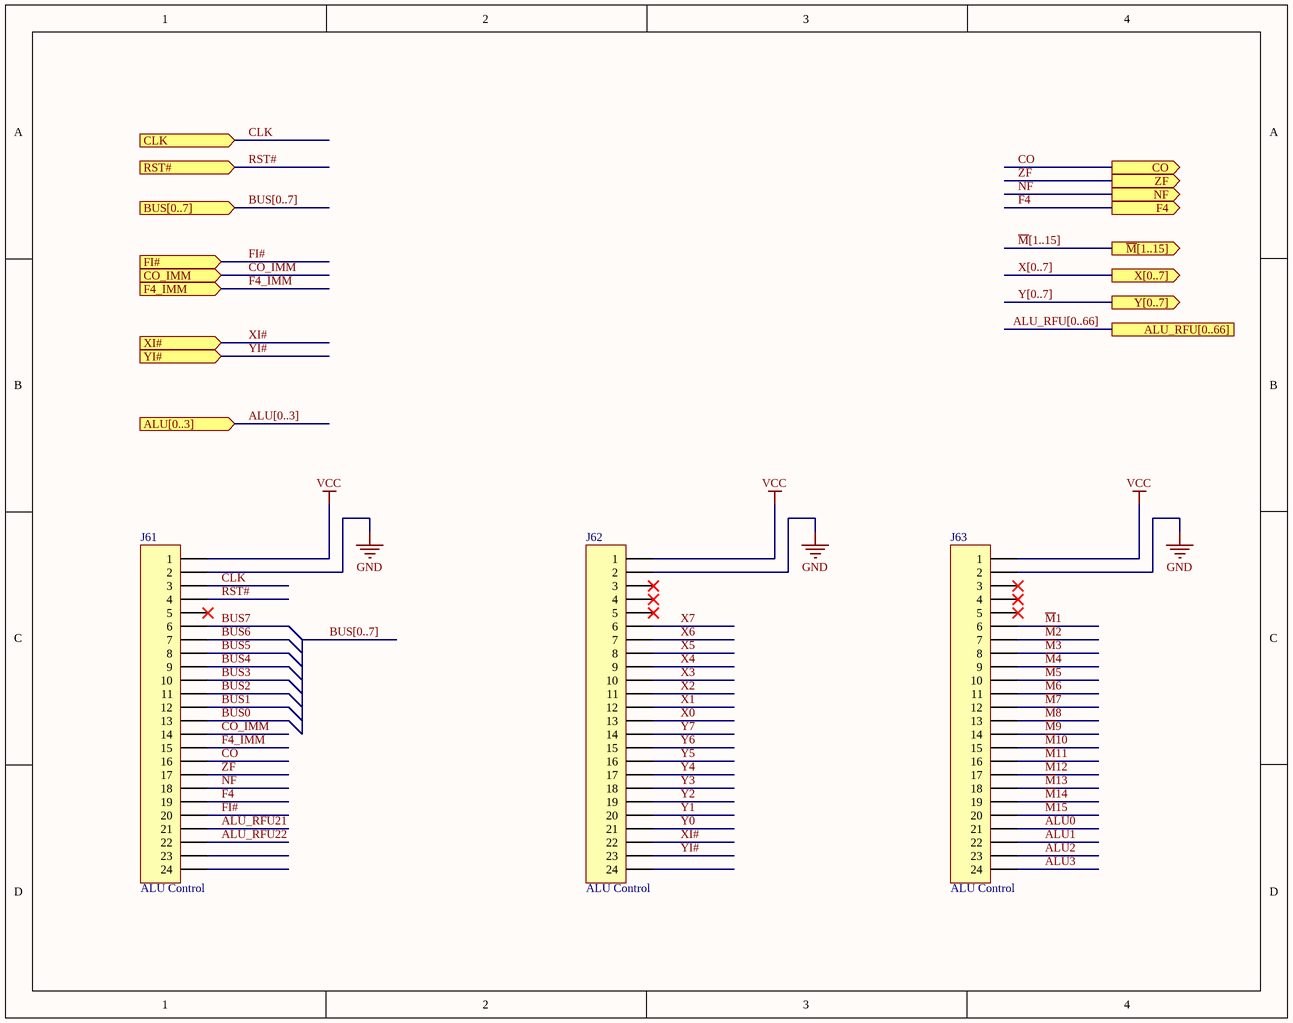
[diagram p8: ALU_Ctrl.SchDoc]

### Parts
J61  ALU Control  [HDR1X24]
J62  ALU Control  [HDR1X24]
J63  ALU Control  [HDR1X24]

### Ports
ALU[0..3] (in), ALU_RFU[0..66], BUS[0..7] (in), CLK (in), CO (out), CO_IMM (in), F4 (out), F4_IMM (in), FI# (in), NF (out), RST# (in), X[0..7] (out), XI# (in), Y[0..7] (out), YI# (in), ZF (out), ~{M}[1..15] (out)

### Nets
GND: J61.2 J62.2 J63.2
VCC: J61.1 J62.1 J63.1
ALU0: J63.21
ALU1: J63.22
ALU2: J63.23
ALU3: J63.24
ALU_RFU21: J61.21
ALU_RFU22: J61.22
BUS0: J61.13
BUS1: J61.12
BUS2: J61.11
BUS3: J61.10
BUS4: J61.9
BUS5: J61.8
BUS6: J61.7
BUS7: J61.6
CLK: J61.3 ; port CLK
CO: J61.16 ; port CO
CO_IMM: J61.14 ; port CO_IMM
F4: J61.19 ; port F4
F4_IMM: J61.15 ; port F4_IMM
FI#: J61.20 ; port FI#
~{M}1: J63.6
~{M}2: J63.7
~{M}3: J63.8
~{M}4: J63.9
~{M}5: J63.10
~{M}6: J63.11
~{M}7: J63.12
~{M}8: J63.13
~{M}9: J63.14
~{M}10: J63.15
~{M}11: J63.16
~{M}12: J63.17
~{M}13: J63.18
~{M}14: J63.19
~{M}15: J63.20
NF: J61.18 ; port NF
RST#: J61.4 ; port RST#
X0: J62.13
X1: J62.12
X2: J62.11
X3: J62.10
X4: J62.9
X5: J62.8
X6: J62.7
X7: J62.6
XI#: J62.22 ; port XI#
Y0: J62.21
Y1: J62.20
Y2: J62.19
Y3: J62.18
Y4: J62.17
Y5: J62.16
Y6: J62.15
Y7: J62.14
YI#: J62.23 ; port YI#
ZF: J61.17 ; port ZF

Not connected (* = marked no-connect by the designer): J61 5* 23 24; J62 3* 4* 5* 24; J63 3* 4* 5*

### Buses and harness runs
bus ALU[0..3] = port ALU[0..3]
bus ALU_RFU[0..66] = port ALU_RFU[0..66]
bus BUS[0..7]
bus BUS[0..7] = port BUS[0..7]
bus X[0..7] = port X[0..7]
bus Y[0..7] = port Y[0..7]
bus ~{M}[1..15] = port ~{M}[1..15]

### Notes on the sheet
- Let's Build Rocket's Inc. Modular Paylaod System Based on TMP-010 Rev
  For more information visit https://github.com/LetsBuildRockets/Modular-Payload-System
  This work is licensed under CC BY-NC 4.0. To view a copy of this license, visit https://creativecommons.org/licenses/by-nc/4.0
- Title
- Size:
- Date:
- Assembly Variant:
- B
- Number:
- Time:
- Revision:
- Sheet
- of
- Author:
- File:

### Library data of the parts
J61-J63 = Header 24: Header, 24-Pin; System: Connector; LatestRevisionDate: 17-Jul-2002; LatestRevisionNote: Re-released for DXP Platform.; Publisher: Altium Limited

## Sheet ALU Connector.SchDoc
size A; Author: E. Sims; Organization: Let's Build Rockets Inc.; SheetNumber: 9; SheetTotal: 11
Used 5 times, as channels ALU1, ALU2, ALU3, ALU4, ALU5. Parts and nets are listed once, with the designators drawn on the sheet.
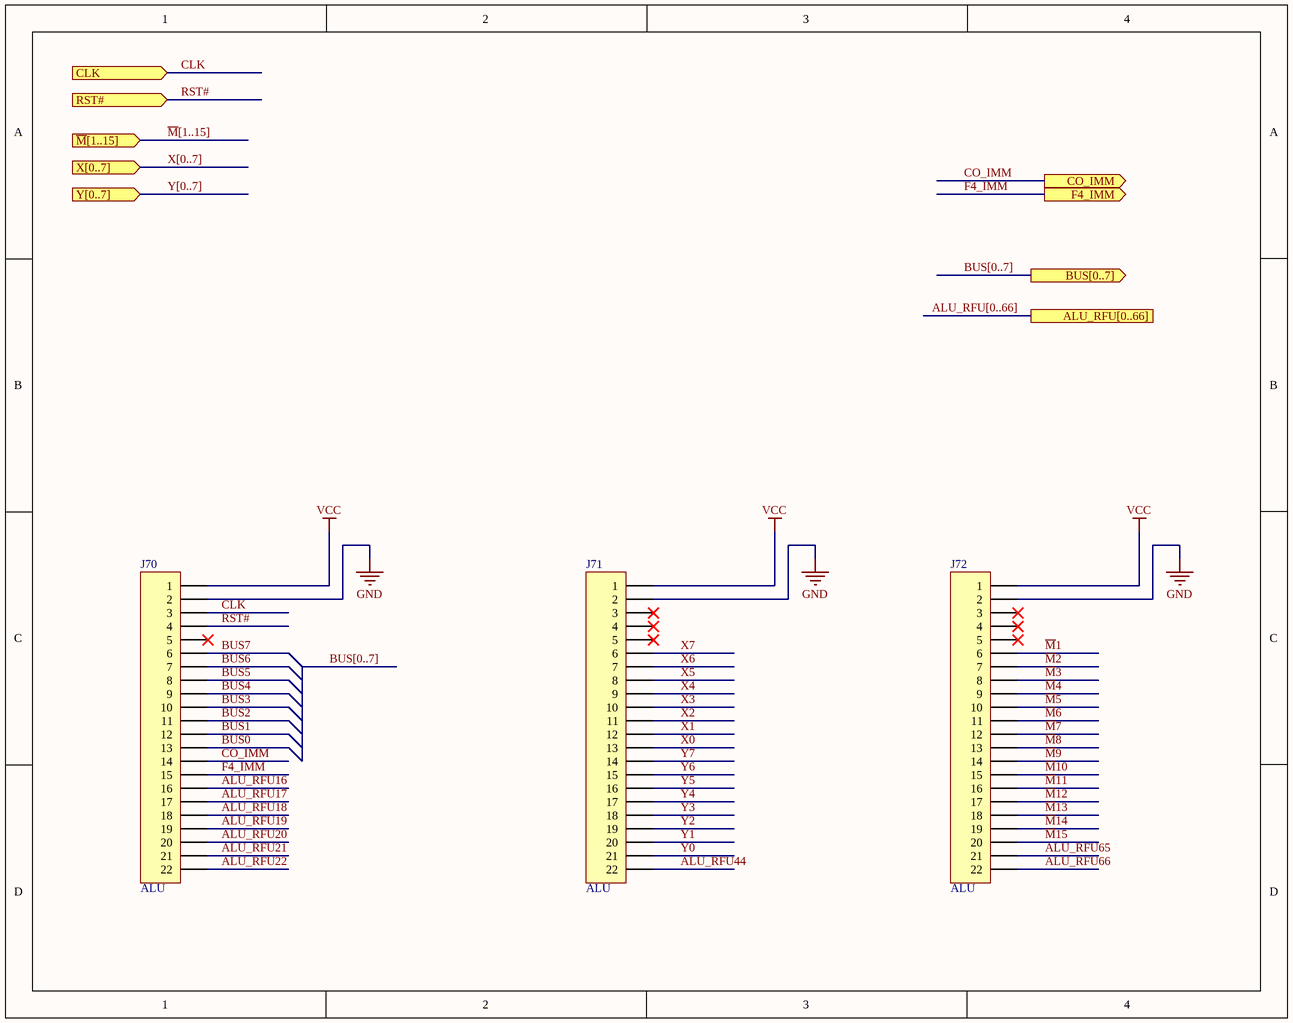
[diagram p9: ALU Connector.SchDoc]

### Parts
J70  ALU  [HDR1X22]
J71  ALU  [HDR1X22]
J72  ALU  [HDR1X22]

### Ports
ALU_RFU[0..66], BUS[0..7] (out), CLK (in), CO_IMM (out), F4_IMM (out), RST# (in), X[0..7] (in), Y[0..7] (in), ~{M}[1..15] (in)

### Nets
GND: J70.2 J71.2 J72.2
VCC: J70.1 J71.1 J72.1
ALU_RFU16: J70.16
ALU_RFU17: J70.17
ALU_RFU18: J70.18
ALU_RFU19: J70.19
ALU_RFU20: J70.20
ALU_RFU21: J70.21
ALU_RFU22: J70.22
ALU_RFU44: J71.22
ALU_RFU65: J72.21
ALU_RFU66: J72.22
BUS0: J70.13
BUS1: J70.12
BUS2: J70.11
BUS3: J70.10
BUS4: J70.9
BUS5: J70.8
BUS6: J70.7
BUS7: J70.6
CLK: J70.3 ; port CLK
CO_IMM: J70.14 ; port CO_IMM
F4_IMM: J70.15 ; port F4_IMM
~{M}1: J72.6
~{M}2: J72.7
~{M}3: J72.8
~{M}4: J72.9
~{M}5: J72.10
~{M}6: J72.11
~{M}7: J72.12
~{M}8: J72.13
~{M}9: J72.14
~{M}10: J72.15
~{M}11: J72.16
~{M}12: J72.17
~{M}13: J72.18
~{M}14: J72.19
~{M}15: J72.20
RST#: J70.4 ; port RST#
X0: J71.13
X1: J71.12
X2: J71.11
X3: J71.10
X4: J71.9
X5: J71.8
X6: J71.7
X7: J71.6
Y0: J71.21
Y1: J71.20
Y2: J71.19
Y3: J71.18
Y4: J71.17
Y5: J71.16
Y6: J71.15
Y7: J71.14

Not connected (* = marked no-connect by the designer): J70 5*; J71 3* 4* 5*; J72 3* 4* 5*

### Channels
ALU1: designators end in 1; ports CLK=CLK CO_IMM=CO_IMM F4_IMM=F4_IMM RST#=RST#
ALU2: designators end in 2; ports CLK=CLK CO_IMM=CO_IMM F4_IMM=F4_IMM RST#=RST#
ALU3: designators end in 3; ports CLK=CLK CO_IMM=CO_IMM F4_IMM=F4_IMM RST#=RST#
ALU4: designators end in 4; ports CLK=CLK CO_IMM=CO_IMM F4_IMM=F4_IMM RST#=RST#
ALU5: designators end in 5; ports CLK=CLK CO_IMM=CO_IMM F4_IMM=F4_IMM RST#=RST#

### Buses and harness runs
bus ALU_RFU[0..66] = port ALU_RFU[0..66]
bus BUS[0..7]
bus BUS[0..7] = port BUS[0..7]
bus X[0..7] = port X[0..7]
bus Y[0..7] = port Y[0..7]
bus ~{M}[1..15] = port ~{M}[1..15]

### Notes on the sheet
- Let's Build Rocket's Inc. Modular Paylaod System Based on TMP-010 Rev
  For more information visit https://github.com/LetsBuildRockets/Modular-Payload-System
  This work is licensed under CC BY-NC 4.0. To view a copy of this license, visit https://creativecommons.org/licenses/by-nc/4.0
- Title
- Size:
- Date:
- Assembly Variant:
- B
- Number:
- Time:
- Revision:
- Sheet
- of
- Author:
- File:

### Library data of the parts
J70-J72 = Header 22: Header, 22-Pin; System: Connector; LatestRevisionDate: 17-Jul-2002; LatestRevisionNote: Re-released for DXP Platform.; Publisher: Altium Limited

## Sheet Power_Clock.SchDoc
size A; Author: E. Sims; Organization: Let's Build Rockets Inc.; SheetNumber: 11; SheetTotal: 11
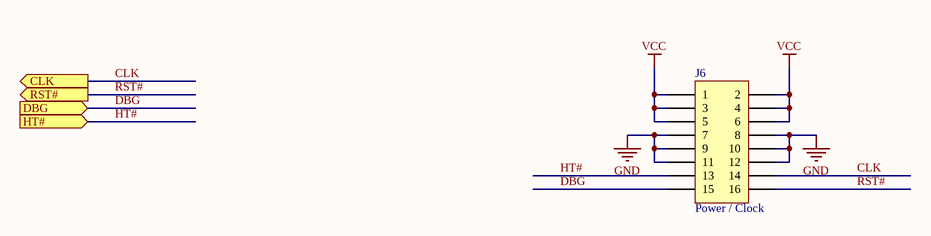
[diagram p10: Power_Clock.SchDoc]

### Parts
J6  Power / Clock  [HDR2X8]

### Ports
CLK (out), DBG (in), HT# (in), RST# (out)

### Nets
GND: J6.7 J6.8 J6.9 J6.10 J6.11 J6.12
VCC: J6.1 J6.2 J6.3 J6.4 J6.5 J6.6
CLK: J6.14 ; port CLK
DBG: J6.15 ; port DBG
HT#: J6.13 ; port HT#
RST#: J6.16 ; port RST#

### Notes on the sheet
- Let's Build Rocket's Inc. Modular Paylaod System Based on TMP-010 Rev
  For more information visit https://github.com/LetsBuildRockets/Modular-Payload-System
  This work is licensed under CC BY-NC 4.0. To view a copy of this license, visit https://creativecommons.org/licenses/by-nc/4.0
- Title
- Size:
- Date:
- Assembly Variant:
- B
- Number:
- Time:
- Revision:
- Sheet
- of
- Author:
- File:

### Library data of the parts
J6 = Header 8X2: Header, 8-Pin, Dual row; System: Connector; LatestRevisionDate: 17-Jul-2002; LatestRevisionNote: Re-released for DXP Platform.; Publisher: Altium Limited

## Nets that join several sheets
GND: Backplane (6 pins), Register (J4.2), Memory Address Register (J1.3 J1.4), M1 (J21.3 J21.4), M2 (J22.3 J22.4), M3 (J23.3 J23.4), M4 (J24.3 J24.4), M5 (J25.3 J25.4), M6 (J26.3 J26.4), M7 (J27.3 J27.4), M8 (J28.3 J28.4), M9 (J29.3 J29.4), M10 (J210.3 J210.4), M11 (J211.3 J211.4), M12 (J212.3 J212.4), Program Counter (J3.3 J3.4), Scratch (J5.2), Memory Address Decoder (J10.3 J10.4), Control Logic (J30.3 J30.4 J32.3 J32.4), ALU_Ctrl (J61.2 J62.2 J63.2), ALU1 (J701.2 J711.2 J721.2), ALU2 (J702.2 J712.2 J722.2), ALU3 (J703.2 J713.2 J723.2), ALU4 (J704.2 J714.2 J724.2), ALU5 (J705.2 J715.2 J725.2), Power_Clock (6 pins)
VCC: Backplane (TP9.1 TP13.1), Register (J4.1), Memory Address Register (J1.1 J1.2), M1 (J21.1 J21.2), M2 (J22.1 J22.2), M3 (J23.1 J23.2), M4 (J24.1 J24.2), M5 (J25.1 J25.2), M6 (J26.1 J26.2), M7 (J27.1 J27.2), M8 (J28.1 J28.2), M9 (J29.1 J29.2), M10 (J210.1 J210.2), M11 (J211.1 J211.2), M12 (J212.1 J212.2), Program Counter (J3.1 J3.2), Scratch (J5.1), Memory Address Decoder (J10.1 J10.2), Control Logic (J30.1 J30.2 J32.1 J32.2), ALU_Ctrl (J61.1 J62.1 J63.1), ALU1 (J701.1 J711.1 J721.1), ALU2 (J702.1 J712.1 J722.1), ALU3 (J703.1 J713.1 J723.1), ALU4 (J704.1 J714.1 J724.1), ALU5 (J705.1 J715.1 J725.1), Power_Clock (6 pins)
ADDR0: Memory Address Register (J1.6), M1 (J21.6), M2 (J22.6), M3 (J23.6), M4 (J24.6), M5 (J25.6), M6 (J26.6), M7 (J27.6), M8 (J28.6), M9 (J29.6), M10 (J210.6), M11 (J211.6), M12 (J212.6), Memory Address Decoder (J10.6), Control Logic (J32.5)
ADDR1: Memory Address Register (J1.8), M1 (J21.8), M2 (J22.8), M3 (J23.8), M4 (J24.8), M5 (J25.8), M6 (J26.8), M7 (J27.8), M8 (J28.8), M9 (J29.8), M10 (J210.8), M11 (J211.8), M12 (J212.8), Memory Address Decoder (J10.8), Control Logic (J32.7)
ADDR2: Memory Address Register (J1.10), M1 (J21.10), M2 (J22.10), M3 (J23.10), M4 (J24.10), M5 (J25.10), M6 (J26.10), M7 (J27.10), M8 (J28.10), M9 (J29.10), M10 (J210.10), M11 (J211.10), M12 (J212.10), Memory Address Decoder (J10.10), Control Logic (J32.9)
ADDR3: Memory Address Register (J1.12), M1 (J21.12), M2 (J22.12), M3 (J23.12), M4 (J24.12), M5 (J25.12), M6 (J26.12), M7 (J27.12), M8 (J28.12), M9 (J29.12), M10 (J210.12), M11 (J211.12), M12 (J212.12), Memory Address Decoder (J10.12), Control Logic (J32.11)
ADDR4: Memory Address Register (J1.14), M1 (J21.14), M2 (J22.14), M3 (J23.14), M4 (J24.14), M5 (J25.14), M6 (J26.14), M7 (J27.14), M8 (J28.14), M9 (J29.14), M10 (J210.14), M11 (J211.14), M12 (J212.14), Memory Address Decoder (J10.14), Control Logic (J32.13)
ADDR5: Memory Address Register (J1.16), M1 (J21.16), M2 (J22.16), M3 (J23.16), M4 (J24.16), M5 (J25.16), M6 (J26.16), M7 (J27.16), M8 (J28.16), M9 (J29.16), M10 (J210.16), M11 (J211.16), M12 (J212.16), Memory Address Decoder (J10.16), Control Logic (J32.15)
ADDR6: Memory Address Register (J1.18), M1 (J21.18), M2 (J22.18), M3 (J23.18), M4 (J24.18), M5 (J25.18), M6 (J26.18), M7 (J27.18), M8 (J28.18), M9 (J29.18), M10 (J210.18), M11 (J211.18), M12 (J212.18), Memory Address Decoder (J10.18), Control Logic (J32.17)
ADDR7: Memory Address Register (J1.20), M1 (J21.20), M2 (J22.20), M3 (J23.20), M4 (J24.20), M5 (J25.20), M6 (J26.20), M7 (J27.20), M8 (J28.20), M9 (J29.20), M10 (J210.20), M11 (J211.20), M12 (J212.20), Memory Address Decoder (J10.20), Control Logic (J32.19)
ADDR8: Memory Address Register (J1.22), M1 (J21.22), M2 (J22.22), M3 (J23.22), M4 (J24.22), M5 (J25.22), M6 (J26.22), M7 (J27.22), M8 (J28.22), M9 (J29.22), M10 (J210.22), M11 (J211.22), M12 (J212.22), Memory Address Decoder (J10.22), Control Logic (J32.21)
ADDR9: Memory Address Register (J1.24), M1 (J21.24), M2 (J22.24), M3 (J23.24), M4 (J24.24), M5 (J25.24), M6 (J26.24), M7 (J27.24), M8 (J28.24), M9 (J29.24), M10 (J210.24), M11 (J211.24), M12 (J212.24), Memory Address Decoder (J10.24), Control Logic (J32.23)
ADDR10: Memory Address Register (J1.26), M1 (J21.26), M2 (J22.26), M3 (J23.26), M4 (J24.26), M5 (J25.26), M6 (J26.26), M7 (J27.26), M8 (J28.26), M9 (J29.26), M10 (J210.26), M11 (J211.26), M12 (J212.26), Memory Address Decoder (J10.26), Control Logic (J32.25)
ADDR11: Memory Address Register (J1.28), M1 (J21.28), M2 (J22.28), M3 (J23.28), M4 (J24.28), M5 (J25.28), M6 (J26.28), M7 (J27.28), M8 (J28.28), M9 (J29.28), M10 (J210.28), M11 (J211.28), M12 (J212.28), Memory Address Decoder (J10.28), Control Logic (J32.27)
ADDR12: Memory Address Register (J1.30), M1 (J21.30), M2 (J22.30), M3 (J23.30), M4 (J24.30), M5 (J25.30), M6 (J26.30), M7 (J27.30), M8 (J28.30), M9 (J29.30), M10 (J210.30), M11 (J211.30), M12 (J212.30), Memory Address Decoder (J10.30), Control Logic (J32.29)
ADDR13: Memory Address Register (J1.32), M1 (J21.32), M2 (J22.32), M3 (J23.32), M4 (J24.32), M5 (J25.32), M6 (J26.32), M7 (J27.32), M8 (J28.32), M9 (J29.32), M10 (J210.32), M11 (J211.32), M12 (J212.32), Memory Address Decoder (J10.32), Control Logic (J32.31)
ADDR14: Memory Address Register (J1.34), M1 (J21.34), M2 (J22.34), M3 (J23.34), M4 (J24.34), M5 (J25.34), M6 (J26.34), M7 (J27.34), M8 (J28.34), M9 (J29.34), M10 (J210.34), M11 (J211.34), M12 (J212.34), Memory Address Decoder (J10.34), Control Logic (J32.33)
ADDR15: Memory Address Register (J1.36), M1 (J21.36), M2 (J22.36), M3 (J23.36), M4 (J24.36), M5 (J25.36), M6 (J26.36), M7 (J27.36), M8 (J28.36), M9 (J29.36), M10 (J210.36), M11 (J211.36), M12 (J212.36), Memory Address Decoder (J10.36), Control Logic (J32.35)
ADDR16: Memory Address Register (J1.38), M1 (J21.38), M2 (J22.38), M3 (J23.38), M4 (J24.38), M5 (J25.38), M6 (J26.38), M7 (J27.38), M8 (J28.38), M9 (J29.38), M10 (J210.38), M11 (J211.38), M12 (J212.38), Memory Address Decoder (J10.38), Control Logic (J32.37)
ADDR17: Memory Address Register (J1.40), M1 (J21.40), M2 (J22.40), M3 (J23.40), M4 (J24.40), M5 (J25.40), M6 (J26.40), M7 (J27.40), M8 (J28.40), M9 (J29.40), M10 (J210.40), M11 (J211.40), M12 (J212.40), Memory Address Decoder (J10.40), Control Logic (J32.39)
ADDR18: Memory Address Register (J1.42), M1 (J21.21), M2 (J22.21), M3 (J23.21), M4 (J24.21), M5 (J25.21), M6 (J26.21), M7 (J27.21), M8 (J28.21), M9 (J29.21), M10 (J210.21), M11 (J211.21), M12 (J212.21), Memory Address Decoder (J10.42), Control Logic (J32.22)
ADDR19: Memory Address Register (J1.44), M1 (J21.23), M2 (J22.23), M3 (J23.23), M4 (J24.23), M5 (J25.23), M6 (J26.23), M7 (J27.23), M8 (J28.23), M9 (J29.23), M10 (J210.23), M11 (J211.23), M12 (J212.23), Memory Address Decoder (J10.44), Control Logic (J32.24)
AI#: Register (J4.14), Control Logic (J30.26)
ALU0: Control Logic (J31.34), ALU_Ctrl (J63.21)
ALU1: Control Logic (J31.36), ALU_Ctrl (J63.22)
ALU2: Control Logic (J31.38), ALU_Ctrl (J63.23)
ALU3: Control Logic (J31.40), ALU_Ctrl (J63.24)
ALU_RFU16: ALU1 (J701.16), ALU2 (J702.16), ALU3 (J703.16), ALU4 (J704.16), ALU5 (J705.16)
ALU_RFU17: ALU1 (J701.17), ALU2 (J702.17), ALU3 (J703.17), ALU4 (J704.17), ALU5 (J705.17)
ALU_RFU18: ALU1 (J701.18), ALU2 (J702.18), ALU3 (J703.18), ALU4 (J704.18), ALU5 (J705.18)
ALU_RFU19: ALU1 (J701.19), ALU2 (J702.19), ALU3 (J703.19), ALU4 (J704.19), ALU5 (J705.19)
ALU_RFU20: ALU1 (J701.20), ALU2 (J702.20), ALU3 (J703.20), ALU4 (J704.20), ALU5 (J705.20)
ALU_RFU21: ALU_Ctrl (J61.21), ALU1 (J701.21), ALU2 (J702.21), ALU3 (J703.21), ALU4 (J704.21), ALU5 (J705.21)
ALU_RFU22: ALU_Ctrl (J61.22), ALU1 (J701.22), ALU2 (J702.22), ALU3 (J703.22), ALU4 (J704.22), ALU5 (J705.22)
ALU_RFU44: ALU1 (J711.22), ALU2 (J712.22), ALU3 (J713.22), ALU4 (J714.22), ALU5 (J715.22)
ALU_RFU65: ALU1 (J721.21), ALU2 (J722.21), ALU3 (J723.21), ALU4 (J724.21), ALU5 (J725.21)
ALU_RFU66: ALU1 (J721.22), ALU2 (J722.22), ALU3 (J723.22), ALU4 (J724.22), ALU5 (J725.22)
AO#: Register (J4.17), Control Logic (J30.32)
AT#: Backplane (TP11.1), Control Logic (J31.9)
BI#: Register (J4.15), Control Logic (J30.28)
BO#: Register (J4.18), Control Logic (J30.34)
BUS0: Register (J4.13), Memory Address Register (J1.25), M1 (J21.5), M2 (J22.5), M3 (J23.5), M4 (J24.5), M5 (J25.5), M6 (J26.5), M7 (J27.5), M8 (J28.5), M9 (J29.5), M10 (J210.5), M11 (J211.5), M12 (J212.5), Program Counter (J3.25), Scratch (J5.13), Control Logic (J32.6), ALU_Ctrl (J61.13), ALU1 (J701.13), ALU2 (J702.13), ALU3 (J703.13), ALU4 (J704.13), ALU5 (J705.13)
BUS1: Register (J4.12), Memory Address Register (J1.23), M1 (J21.7), M2 (J22.7), M3 (J23.7), M4 (J24.7), M5 (J25.7), M6 (J26.7), M7 (J27.7), M8 (J28.7), M9 (J29.7), M10 (J210.7), M11 (J211.7), M12 (J212.7), Program Counter (J3.23), Scratch (J5.12), Control Logic (J32.8), ALU_Ctrl (J61.12), ALU1 (J701.12), ALU2 (J702.12), ALU3 (J703.12), ALU4 (J704.12), ALU5 (J705.12)
BUS2: Register (J4.11), Memory Address Register (J1.21), M1 (J21.9), M2 (J22.9), M3 (J23.9), M4 (J24.9), M5 (J25.9), M6 (J26.9), M7 (J27.9), M8 (J28.9), M9 (J29.9), M10 (J210.9), M11 (J211.9), M12 (J212.9), Program Counter (J3.21), Scratch (J5.11), Control Logic (J32.10), ALU_Ctrl (J61.11), ALU1 (J701.11), ALU2 (J702.11), ALU3 (J703.11), ALU4 (J704.11), ALU5 (J705.11)
BUS3: Register (J4.10), Memory Address Register (J1.19), M1 (J21.11), M2 (J22.11), M3 (J23.11), M4 (J24.11), M5 (J25.11), M6 (J26.11), M7 (J27.11), M8 (J28.11), M9 (J29.11), M10 (J210.11), M11 (J211.11), M12 (J212.11), Program Counter (J3.19), Scratch (J5.10), Control Logic (J32.12), ALU_Ctrl (J61.10), ALU1 (J701.10), ALU2 (J702.10), ALU3 (J703.10), ALU4 (J704.10), ALU5 (J705.10)
BUS4: Register (J4.9), Memory Address Register (J1.17), M1 (J21.13), M2 (J22.13), M3 (J23.13), M4 (J24.13), M5 (J25.13), M6 (J26.13), M7 (J27.13), M8 (J28.13), M9 (J29.13), M10 (J210.13), M11 (J211.13), M12 (J212.13), Program Counter (J3.17), Scratch (J5.9), Control Logic (J32.14), ALU_Ctrl (J61.9), ALU1 (J701.9), ALU2 (J702.9), ALU3 (J703.9), ALU4 (J704.9), ALU5 (J705.9)
BUS5: Register (J4.8), Memory Address Register (J1.15), M1 (J21.15), M2 (J22.15), M3 (J23.15), M4 (J24.15), M5 (J25.15), M6 (J26.15), M7 (J27.15), M8 (J28.15), M9 (J29.15), M10 (J210.15), M11 (J211.15), M12 (J212.15), Program Counter (J3.15), Scratch (J5.8), Control Logic (J32.16), ALU_Ctrl (J61.8), ALU1 (J701.8), ALU2 (J702.8), ALU3 (J703.8), ALU4 (J704.8), ALU5 (J705.8)
BUS6: Register (J4.7), Memory Address Register (J1.13), M1 (J21.17), M2 (J22.17), M3 (J23.17), M4 (J24.17), M5 (J25.17), M6 (J26.17), M7 (J27.17), M8 (J28.17), M9 (J29.17), M10 (J210.17), M11 (J211.17), M12 (J212.17), Program Counter (J3.13), Scratch (J5.7), Control Logic (J32.18), ALU_Ctrl (J61.7), ALU1 (J701.7), ALU2 (J702.7), ALU3 (J703.7), ALU4 (J704.7), ALU5 (J705.7)
BUS7: Register (J4.6), Memory Address Register (J1.11), M1 (J21.19), M2 (J22.19), M3 (J23.19), M4 (J24.19), M5 (J25.19), M6 (J26.19), M7 (J27.19), M8 (J28.19), M9 (J29.19), M10 (J210.19), M11 (J211.19), M12 (J212.19), Program Counter (J3.11), Scratch (J5.6), Control Logic (J32.20), ALU_Ctrl (J61.6), ALU1 (J701.6), ALU2 (J702.6), ALU3 (J703.6), ALU4 (J704.6), ALU5 (J705.6)
CE#: Program Counter (J3.26), Control Logic (J30.25)
CLK: Backplane (TP1.1), Register (J4.3), Memory Address Register (J1.5), M1 (J21.37), M2 (J22.37), M3 (J23.37), M4 (J24.37), M5 (J25.37), M6 (J26.37), M7 (J27.37), M8 (J28.37), M9 (J29.37), M10 (J210.37), M11 (J211.37), M12 (J212.37), Program Counter (J3.5), Scratch (J5.3), Control Logic (J31.6), ALU_Ctrl (J61.3), ALU1 (J701.3), ALU2 (J702.3), ALU3 (J703.3), ALU4 (J704.3), ALU5 (J705.3), Power_Clock (J6.14)
CO: Control Logic (J31.31), ALU_Ctrl (J61.16)
CO_IMM: ALU_Ctrl (J61.14), ALU1 (J701.14), ALU2 (J702.14), ALU3 (J703.14), ALU4 (J704.14), ALU5 (J705.14)
DBG: Backplane (TP12.1), Control Logic (J31.7), Power_Clock (J6.15)
DI#: Scratch (J5.16), Control Logic (J30.18)
DO#: Scratch (J5.19), Control Logic (J30.24)
DS#: Memory Address Register (J1.48), Control Logic (J30.12)
EN1: M1 (J21.39), Memory Address Decoder (J10.5)
EN2: M2 (J22.39), Memory Address Decoder (J10.7)
EN3: M3 (J23.39), Memory Address Decoder (J10.9)
EN4: M4 (J24.39), Memory Address Decoder (J10.11)
EN5: M5 (J25.39), Memory Address Decoder (J10.13)
EN6: M6 (J26.39), Memory Address Decoder (J10.15)
EN7: M7 (J27.39), Memory Address Decoder (J10.17)
EN8: M8 (J28.39), Memory Address Decoder (J10.19)
EN9: M9 (J29.39), Memory Address Decoder (J10.21)
EN10: M10 (J210.39), Memory Address Decoder (J10.23)
EN11: M11 (J211.39), Memory Address Decoder (J10.25)
EN12: M12 (J212.39), Memory Address Decoder (J10.27)
F4: Control Logic (J31.35), ALU_Ctrl (J61.19)
F4_IMM: ALU_Ctrl (J61.15), ALU1 (J701.15), ALU2 (J702.15), ALU3 (J703.15), ALU4 (J704.15), ALU5 (J705.15)
FI#: Control Logic (J31.32), ALU_Ctrl (J61.20)
HI#: Register (J4.16), Control Logic (J30.30)
HO#: Register (J4.19), Control Logic (J30.36)
HT#: Backplane (TP10.1), Control Logic (J31.5), Power_Clock (J6.13)
II#: Program Counter (J3.28), Control Logic (J30.6)
INST0: Program Counter (J3.20), Control Logic (J30.19)
INST1: Program Counter (J3.18), Control Logic (J30.17)
INST2: Program Counter (J3.16), Control Logic (J30.15)
INST3: Program Counter (J3.14), Control Logic (J30.13)
INST4: Program Counter (J3.12), Control Logic (J30.11)
INST5: Program Counter (J3.10), Control Logic (J30.9)
INST6: Program Counter (J3.8), Control Logic (J30.7)
INST7: Program Counter (J3.6), Control Logic (J30.5)
IS#: Memory Address Register (J1.46), Control Logic (J30.10)
JI#: Scratch (J5.14), Control Logic (J30.14)
JO#: Scratch (J5.17), Control Logic (J30.20)
KI#: Scratch (J5.15), Control Logic (J30.16)
KO#: Scratch (J5.18), Control Logic (J30.22)
LM#: Backplane (TP2.1), Register (J4.5), Memory Address Register (J1.9), Program Counter (J3.9), Scratch (J5.5), Control Logic (J31.10)
~{M}1: ALU_Ctrl (J63.6), ALU1 (J721.6), ALU2 (J722.6), ALU3 (J723.6), ALU4 (J724.6), ALU5 (J725.6)
~{M}2: ALU_Ctrl (J63.7), ALU1 (J721.7), ALU2 (J722.7), ALU3 (J723.7), ALU4 (J724.7), ALU5 (J725.7)
~{M}3: ALU_Ctrl (J63.8), ALU1 (J721.8), ALU2 (J722.8), ALU3 (J723.8), ALU4 (J724.8), ALU5 (J725.8)
~{M}4: ALU_Ctrl (J63.9), ALU1 (J721.9), ALU2 (J722.9), ALU3 (J723.9), ALU4 (J724.9), ALU5 (J725.9)
~{M}5: ALU_Ctrl (J63.10), ALU1 (J721.10), ALU2 (J722.10), ALU3 (J723.10), ALU4 (J724.10), ALU5 (J725.10)
~{M}6: ALU_Ctrl (J63.11), ALU1 (J721.11), ALU2 (J722.11), ALU3 (J723.11), ALU4 (J724.11), ALU5 (J725.11)
~{M}7: ALU_Ctrl (J63.12), ALU1 (J721.12), ALU2 (J722.12), ALU3 (J723.12), ALU4 (J724.12), ALU5 (J725.12)
~{M}8: ALU_Ctrl (J63.13), ALU1 (J721.13), ALU2 (J722.13), ALU3 (J723.13), ALU4 (J724.13), ALU5 (J725.13)
~{M}9: ALU_Ctrl (J63.14), ALU1 (J721.14), ALU2 (J722.14), ALU3 (J723.14), ALU4 (J724.14), ALU5 (J725.14)
~{M}10: ALU_Ctrl (J63.15), ALU1 (J721.15), ALU2 (J722.15), ALU3 (J723.15), ALU4 (J724.15), ALU5 (J725.15)
~{M}11: ALU_Ctrl (J63.16), ALU1 (J721.16), ALU2 (J722.16), ALU3 (J723.16), ALU4 (J724.16), ALU5 (J725.16)
~{M}12: ALU_Ctrl (J63.17), ALU1 (J721.17), ALU2 (J722.17), ALU3 (J723.17), ALU4 (J724.17), ALU5 (J725.17)
~{M}13: ALU_Ctrl (J63.18), ALU1 (J721.18), ALU2 (J722.18), ALU3 (J723.18), ALU4 (J724.18), ALU5 (J725.18)
~{M}14: ALU_Ctrl (J63.19), ALU1 (J721.19), ALU2 (J722.19), ALU3 (J723.19), ALU4 (J724.19), ALU5 (J725.19)
~{M}15: ALU_Ctrl (J63.20), ALU1 (J721.20), ALU2 (J722.20), ALU3 (J723.20), ALU4 (J724.20), ALU5 (J725.20)
MA#: Memory Address Register (J1.43), Control Logic (J30.40)
MC#: Memory Address Register (J1.45), Control Logic (J30.8)
MEM_LOAD: Memory Address Register (J1.27), M1 (J21.33), M2 (J22.33), M3 (J23.33), M4 (J24.33), M5 (J25.33), M6 (J26.33), M7 (J27.33), M8 (J28.33), M9 (J29.33), M10 (J210.33), M11 (J211.33), M12 (J212.33), Control Logic (J30.27)
MEM_OUT#: Memory Address Register (J1.29), M1 (J21.31), M2 (J22.31), M3 (J23.31), M4 (J24.31), M5 (J25.31), M6 (J26.31), M7 (J27.31), M8 (J28.31), M9 (J29.31), M10 (J210.31), M11 (J211.31), M12 (J212.31), Control Logic (J30.29)
MI#: Memory Address Register (J1.37), Control Logic (J30.37)
MO#: Memory Address Register (J1.31), Control Logic (J30.31)
NF: Control Logic (J31.33), ALU_Ctrl (J61.18)
NI#: Memory Address Register (J1.39), Control Logic (J30.39)
NO#: Memory Address Register (J1.33), Control Logic (J30.33)
PI#: Program Counter (J3.22), Control Logic (J30.21)
PO#: Program Counter (J3.24), Control Logic (J30.23)
RFU_M25: M1 (J21.25), M2 (J22.25), M3 (J23.25), M4 (J24.25), M5 (J25.25), M6 (J26.25), M7 (J27.25), M8 (J28.25), M9 (J29.25), M10 (J210.25), M11 (J211.25), M12 (J212.25), Control Logic (J32.26)
RFU_M27: M1 (J21.27), M2 (J22.27), M3 (J23.27), M4 (J24.27), M5 (J25.27), M6 (J26.27), M7 (J27.27), M8 (J28.27), M9 (J29.27), M10 (J210.27), M11 (J211.27), M12 (J212.27), Control Logic (J32.28)
RFU_M29: M1 (J21.29), M2 (J22.29), M3 (J23.29), M4 (J24.29), M5 (J25.29), M6 (J26.29), M7 (J27.29), M8 (J28.29), M9 (J29.29), M10 (J210.29), M11 (J211.29), M12 (J212.29), Control Logic (J32.30)
RST#: Backplane (TP15.1), Register (J4.4), Memory Address Register (J1.7), M1 (J21.35), M2 (J22.35), M3 (J23.35), M4 (J24.35), M5 (J25.35), M6 (J26.35), M7 (J27.35), M8 (J28.35), M9 (J29.35), M10 (J210.35), M11 (J211.35), M12 (J212.35), Program Counter (J3.7), Scratch (J5.4), Control Logic (J31.8), ALU_Ctrl (J61.4), ALU1 (J701.4), ALU2 (J702.4), ALU3 (J703.4), ALU4 (J704.4), ALU5 (J705.4), Power_Clock (J6.16)
SI#: Memory Address Register (J1.41), Control Logic (J30.38)
SO#: Memory Address Register (J1.35), Control Logic (J30.35)
X0: ALU_Ctrl (J62.13), ALU1 (J711.13), ALU2 (J712.13), ALU3 (J713.13), ALU4 (J714.13), ALU5 (J715.13)
X1: ALU_Ctrl (J62.12), ALU1 (J711.12), ALU2 (J712.12), ALU3 (J713.12), ALU4 (J714.12), ALU5 (J715.12)
X2: ALU_Ctrl (J62.11), ALU1 (J711.11), ALU2 (J712.11), ALU3 (J713.11), ALU4 (J714.11), ALU5 (J715.11)
X3: ALU_Ctrl (J62.10), ALU1 (J711.10), ALU2 (J712.10), ALU3 (J713.10), ALU4 (J714.10), ALU5 (J715.10)
X4: ALU_Ctrl (J62.9), ALU1 (J711.9), ALU2 (J712.9), ALU3 (J713.9), ALU4 (J714.9), ALU5 (J715.9)
X5: ALU_Ctrl (J62.8), ALU1 (J711.8), ALU2 (J712.8), ALU3 (J713.8), ALU4 (J714.8), ALU5 (J715.8)
X6: ALU_Ctrl (J62.7), ALU1 (J711.7), ALU2 (J712.7), ALU3 (J713.7), ALU4 (J714.7), ALU5 (J715.7)
X7: ALU_Ctrl (J62.6), ALU1 (J711.6), ALU2 (J712.6), ALU3 (J713.6), ALU4 (J714.6), ALU5 (J715.6)
XI#: Control Logic (J31.37), ALU_Ctrl (J62.22)
Y0: ALU_Ctrl (J62.21), ALU1 (J711.21), ALU2 (J712.21), ALU3 (J713.21), ALU4 (J714.21), ALU5 (J715.21)
Y1: ALU_Ctrl (J62.20), ALU1 (J711.20), ALU2 (J712.20), ALU3 (J713.20), ALU4 (J714.20), ALU5 (J715.20)
Y2: ALU_Ctrl (J62.19), ALU1 (J711.19), ALU2 (J712.19), ALU3 (J713.19), ALU4 (J714.19), ALU5 (J715.19)
Y3: ALU_Ctrl (J62.18), ALU1 (J711.18), ALU2 (J712.18), ALU3 (J713.18), ALU4 (J714.18), ALU5 (J715.18)
Y4: ALU_Ctrl (J62.17), ALU1 (J711.17), ALU2 (J712.17), ALU3 (J713.17), ALU4 (J714.17), ALU5 (J715.17)
Y5: ALU_Ctrl (J62.16), ALU1 (J711.16), ALU2 (J712.16), ALU3 (J713.16), ALU4 (J714.16), ALU5 (J715.16)
Y6: ALU_Ctrl (J62.15), ALU1 (J711.15), ALU2 (J712.15), ALU3 (J713.15), ALU4 (J714.15), ALU5 (J715.15)
Y7: ALU_Ctrl (J62.14), ALU1 (J711.14), ALU2 (J712.14), ALU3 (J713.14), ALU4 (J714.14), ALU5 (J715.14)
YI#: Control Logic (J31.39), ALU_Ctrl (J62.23)
ZF: Control Logic (J31.29), ALU_Ctrl (J61.17)